# EAGLE board DRYER CONTROLLER (EAGLE 7.4.0), part 1 of 3
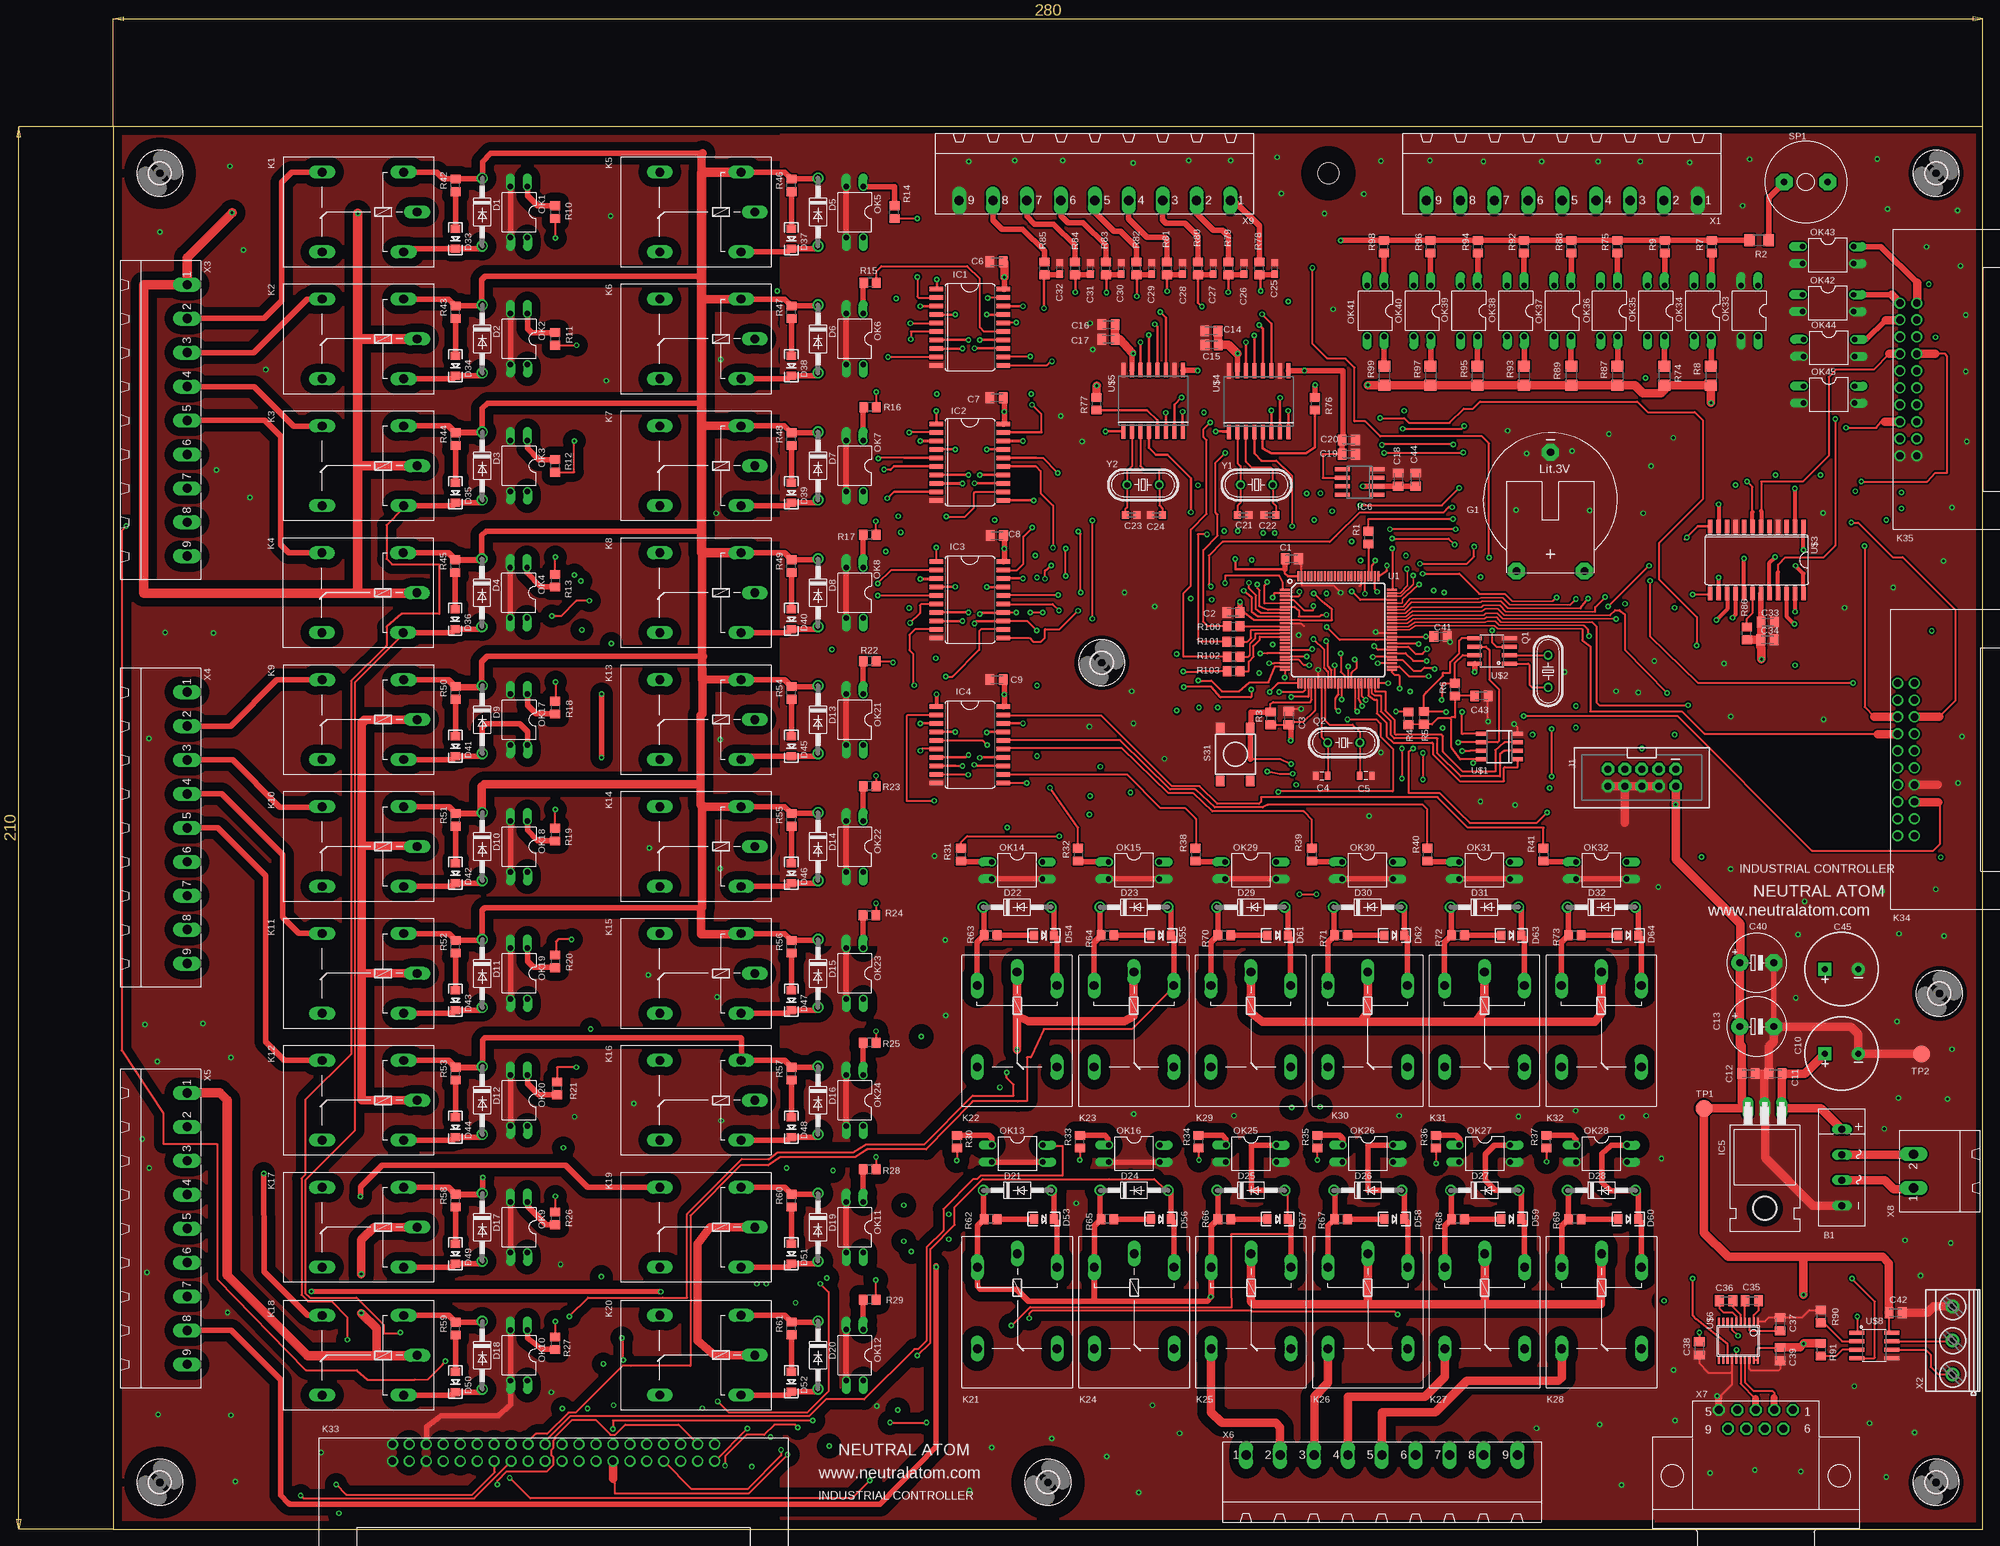
[diagram p6: board, top side]
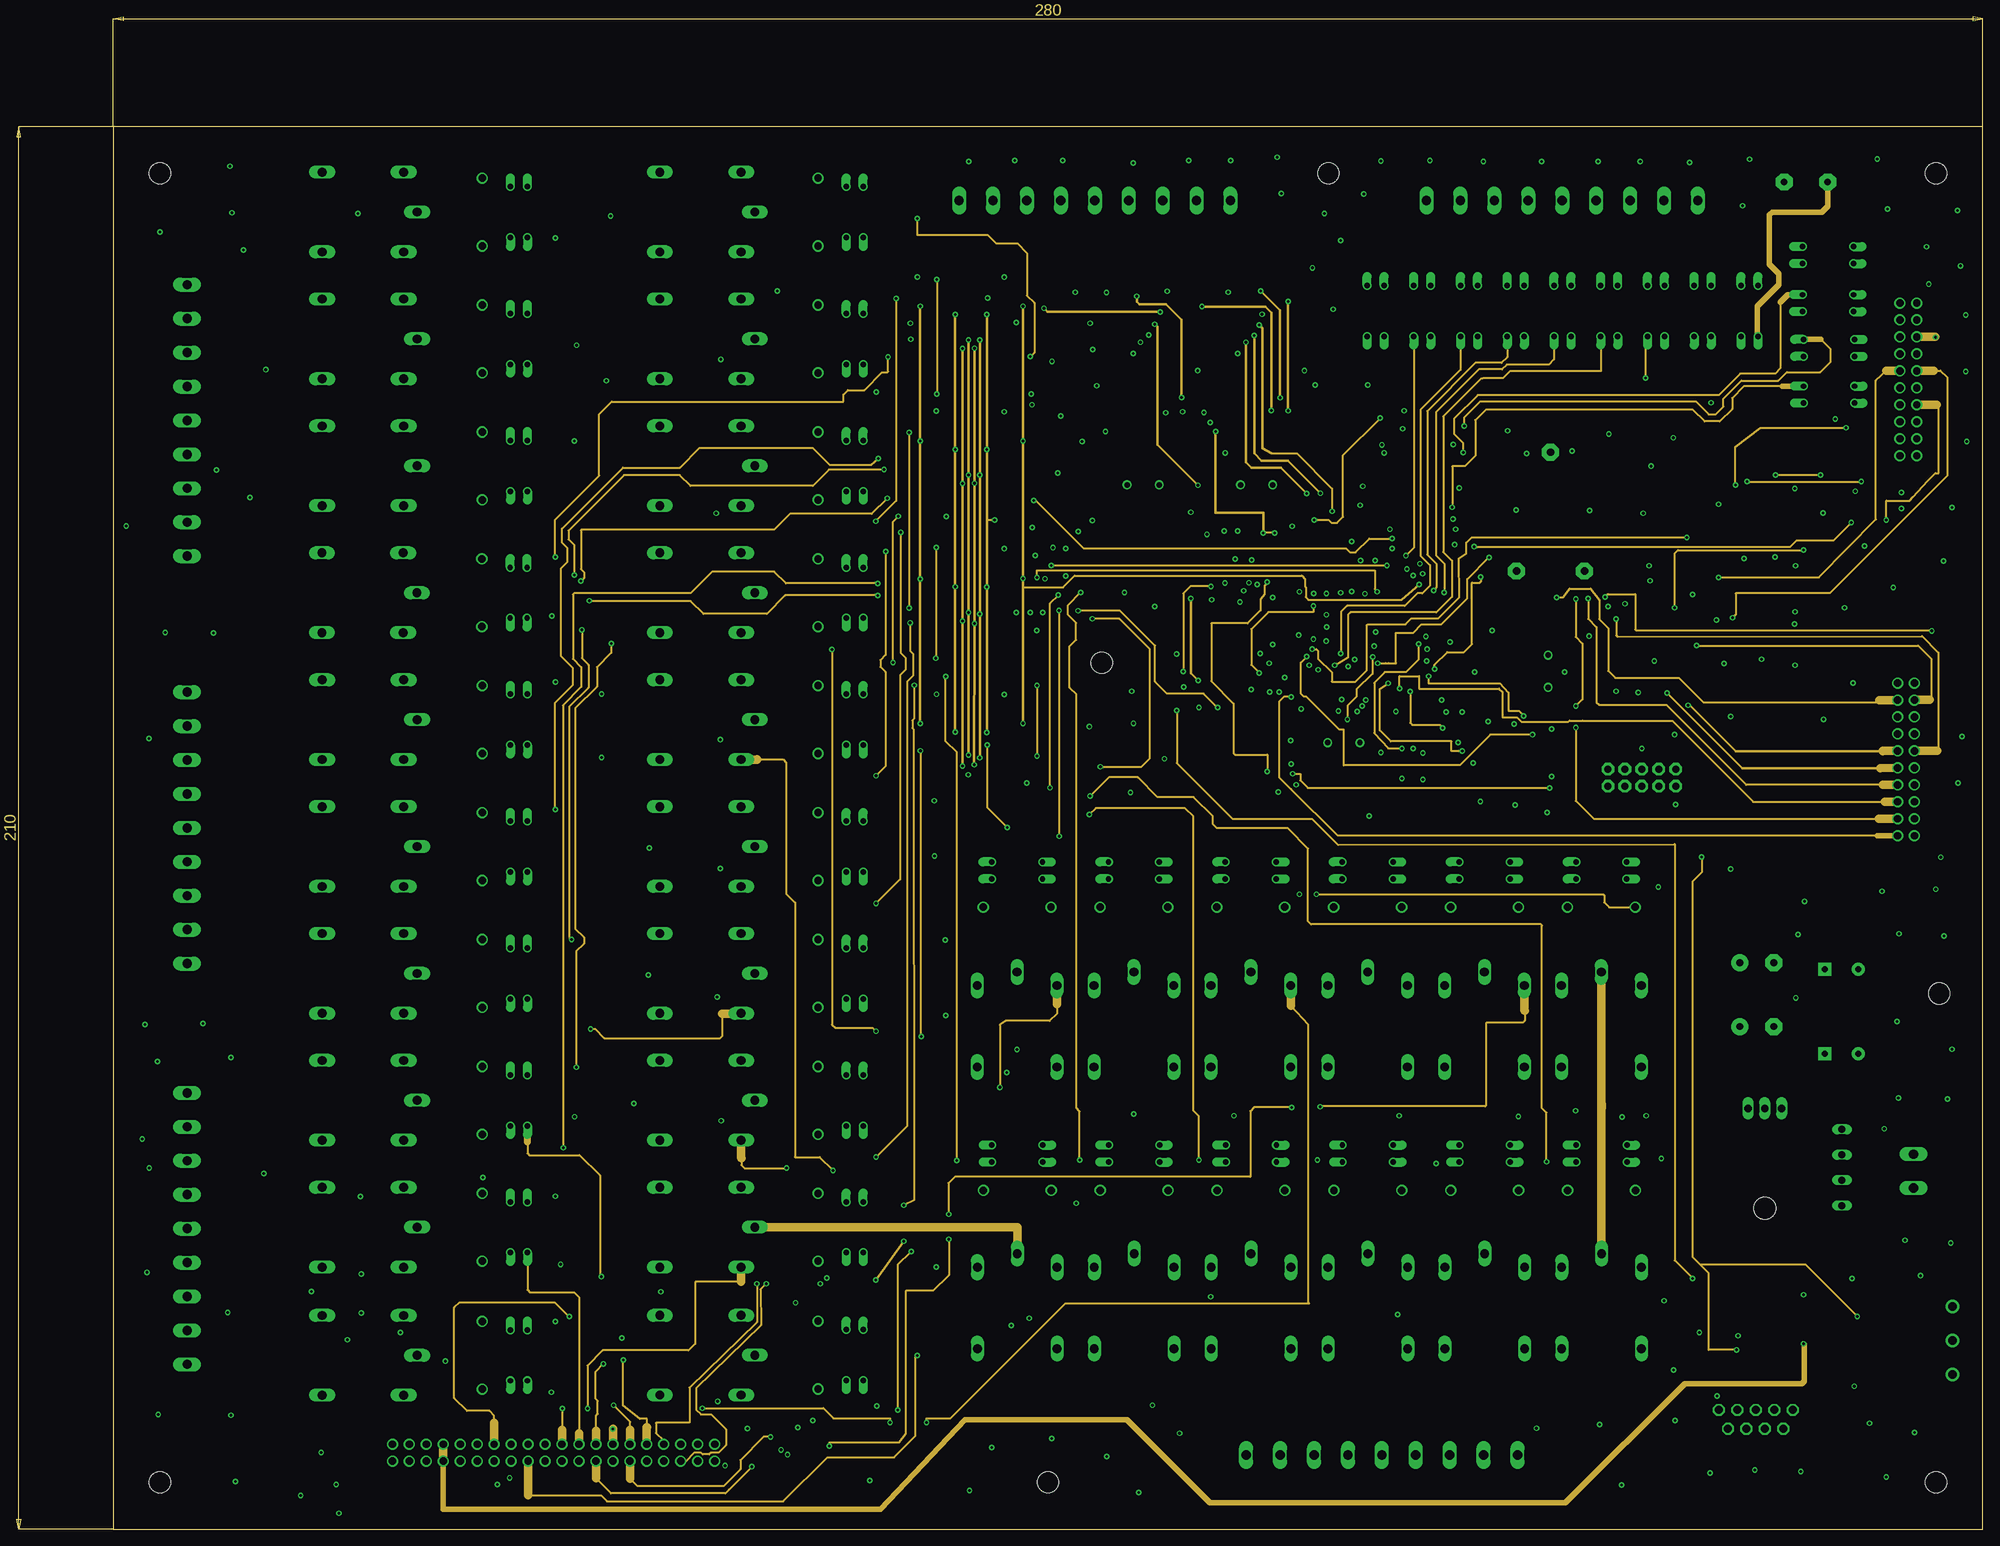
[diagram p7: board, inner layer Route2]
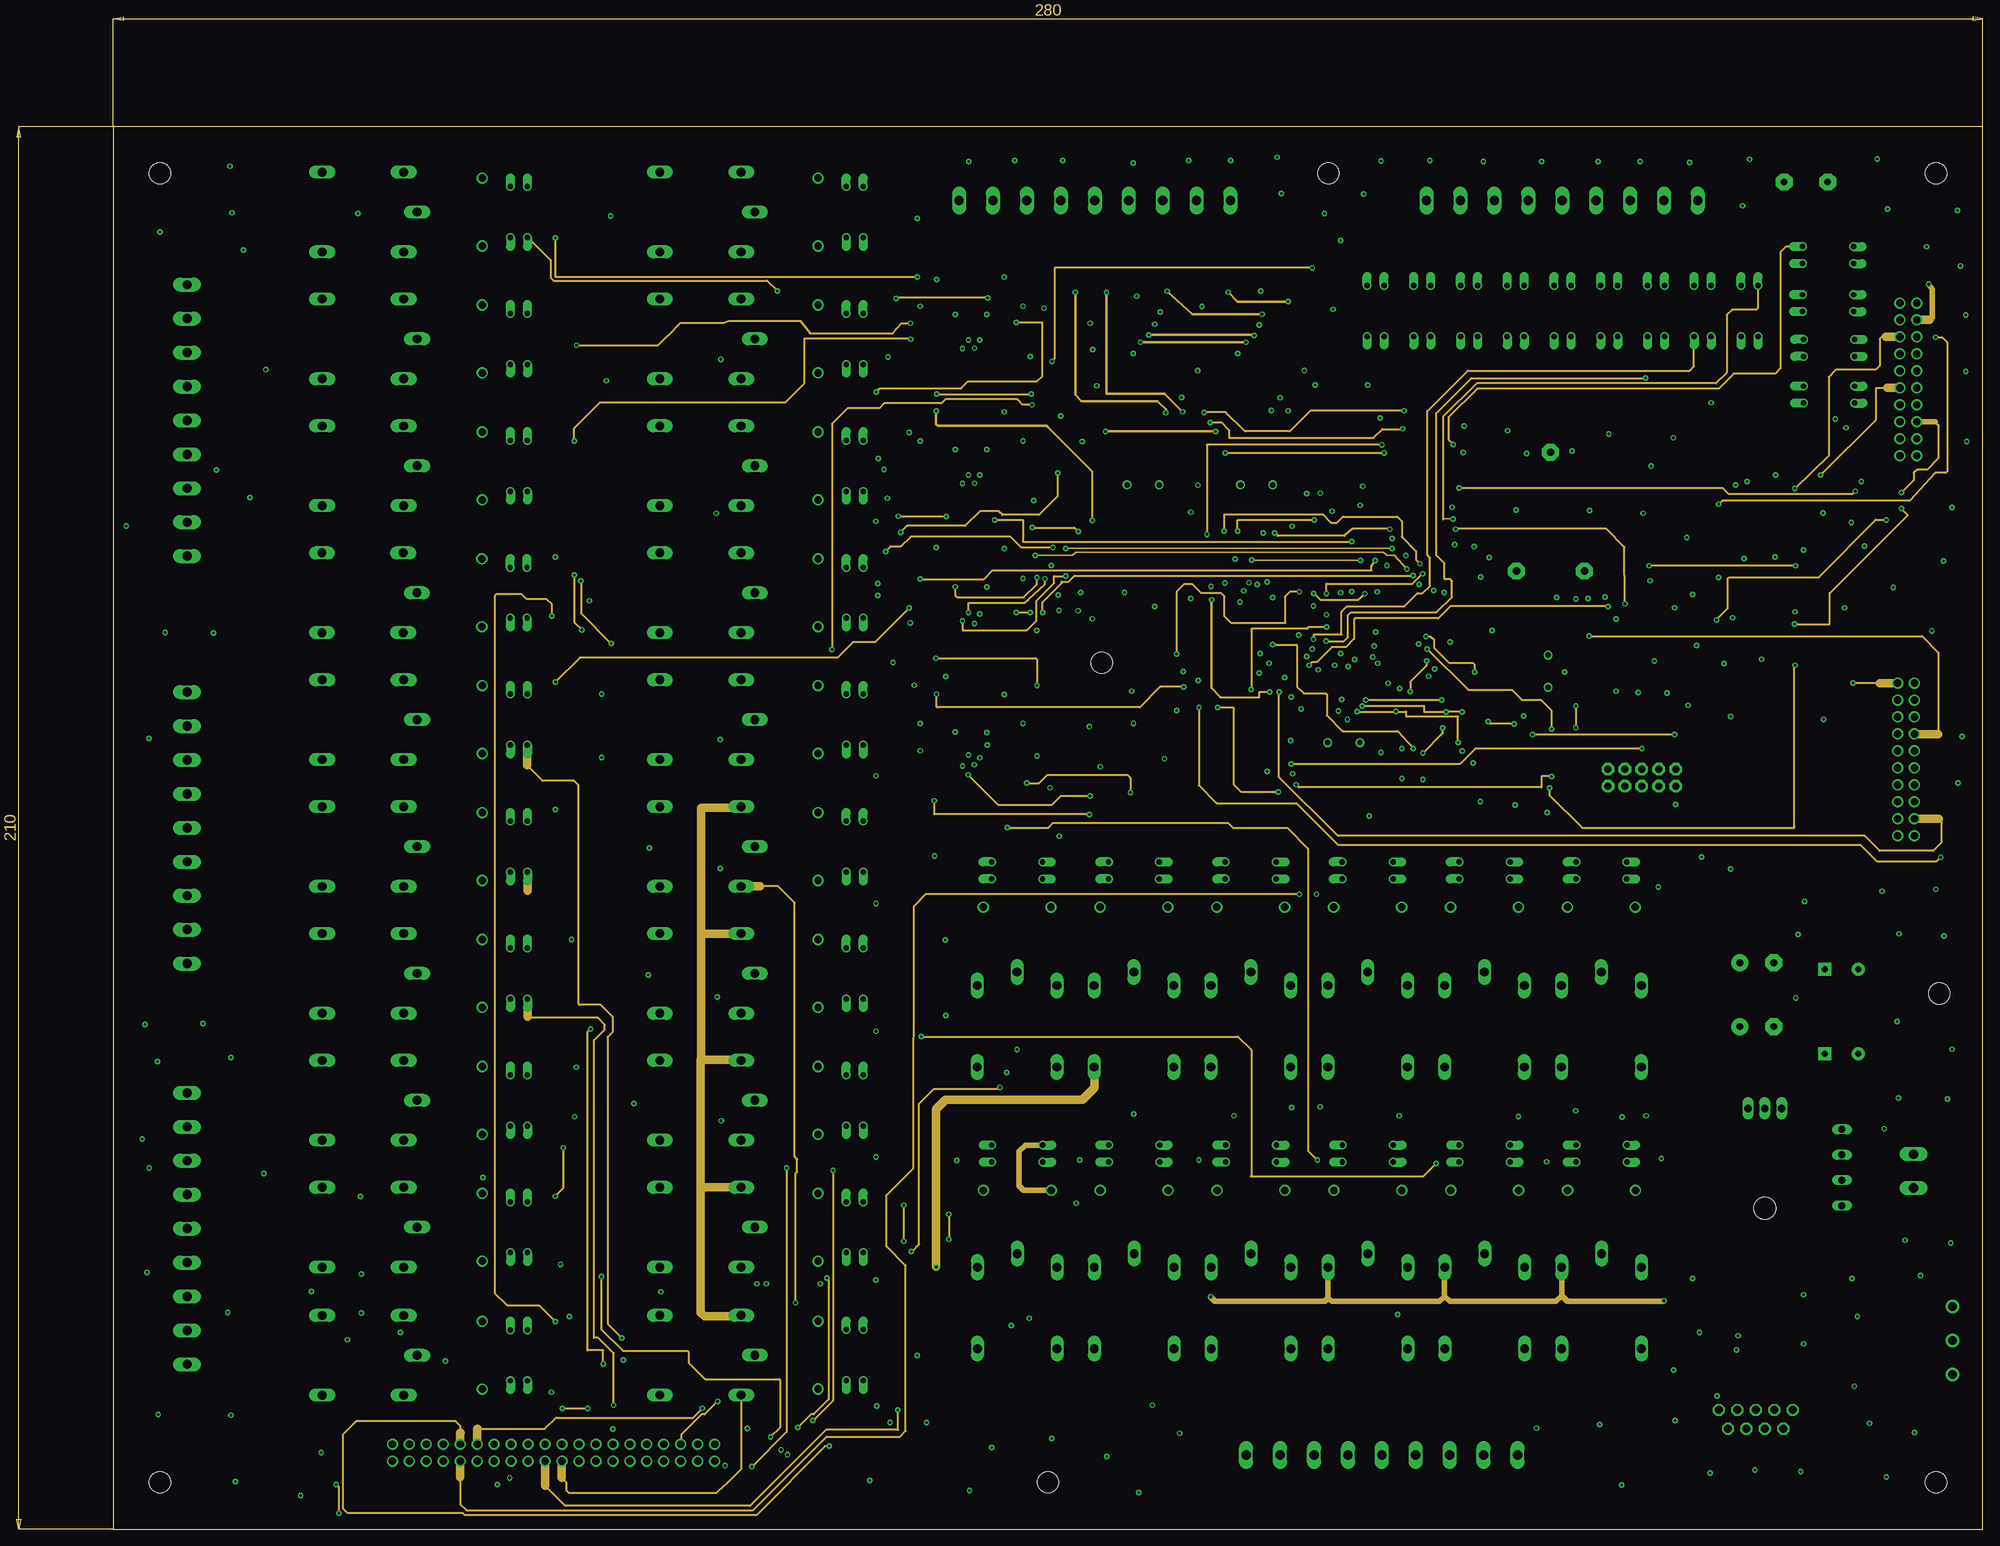
[diagram p8: board, inner layer Route15]
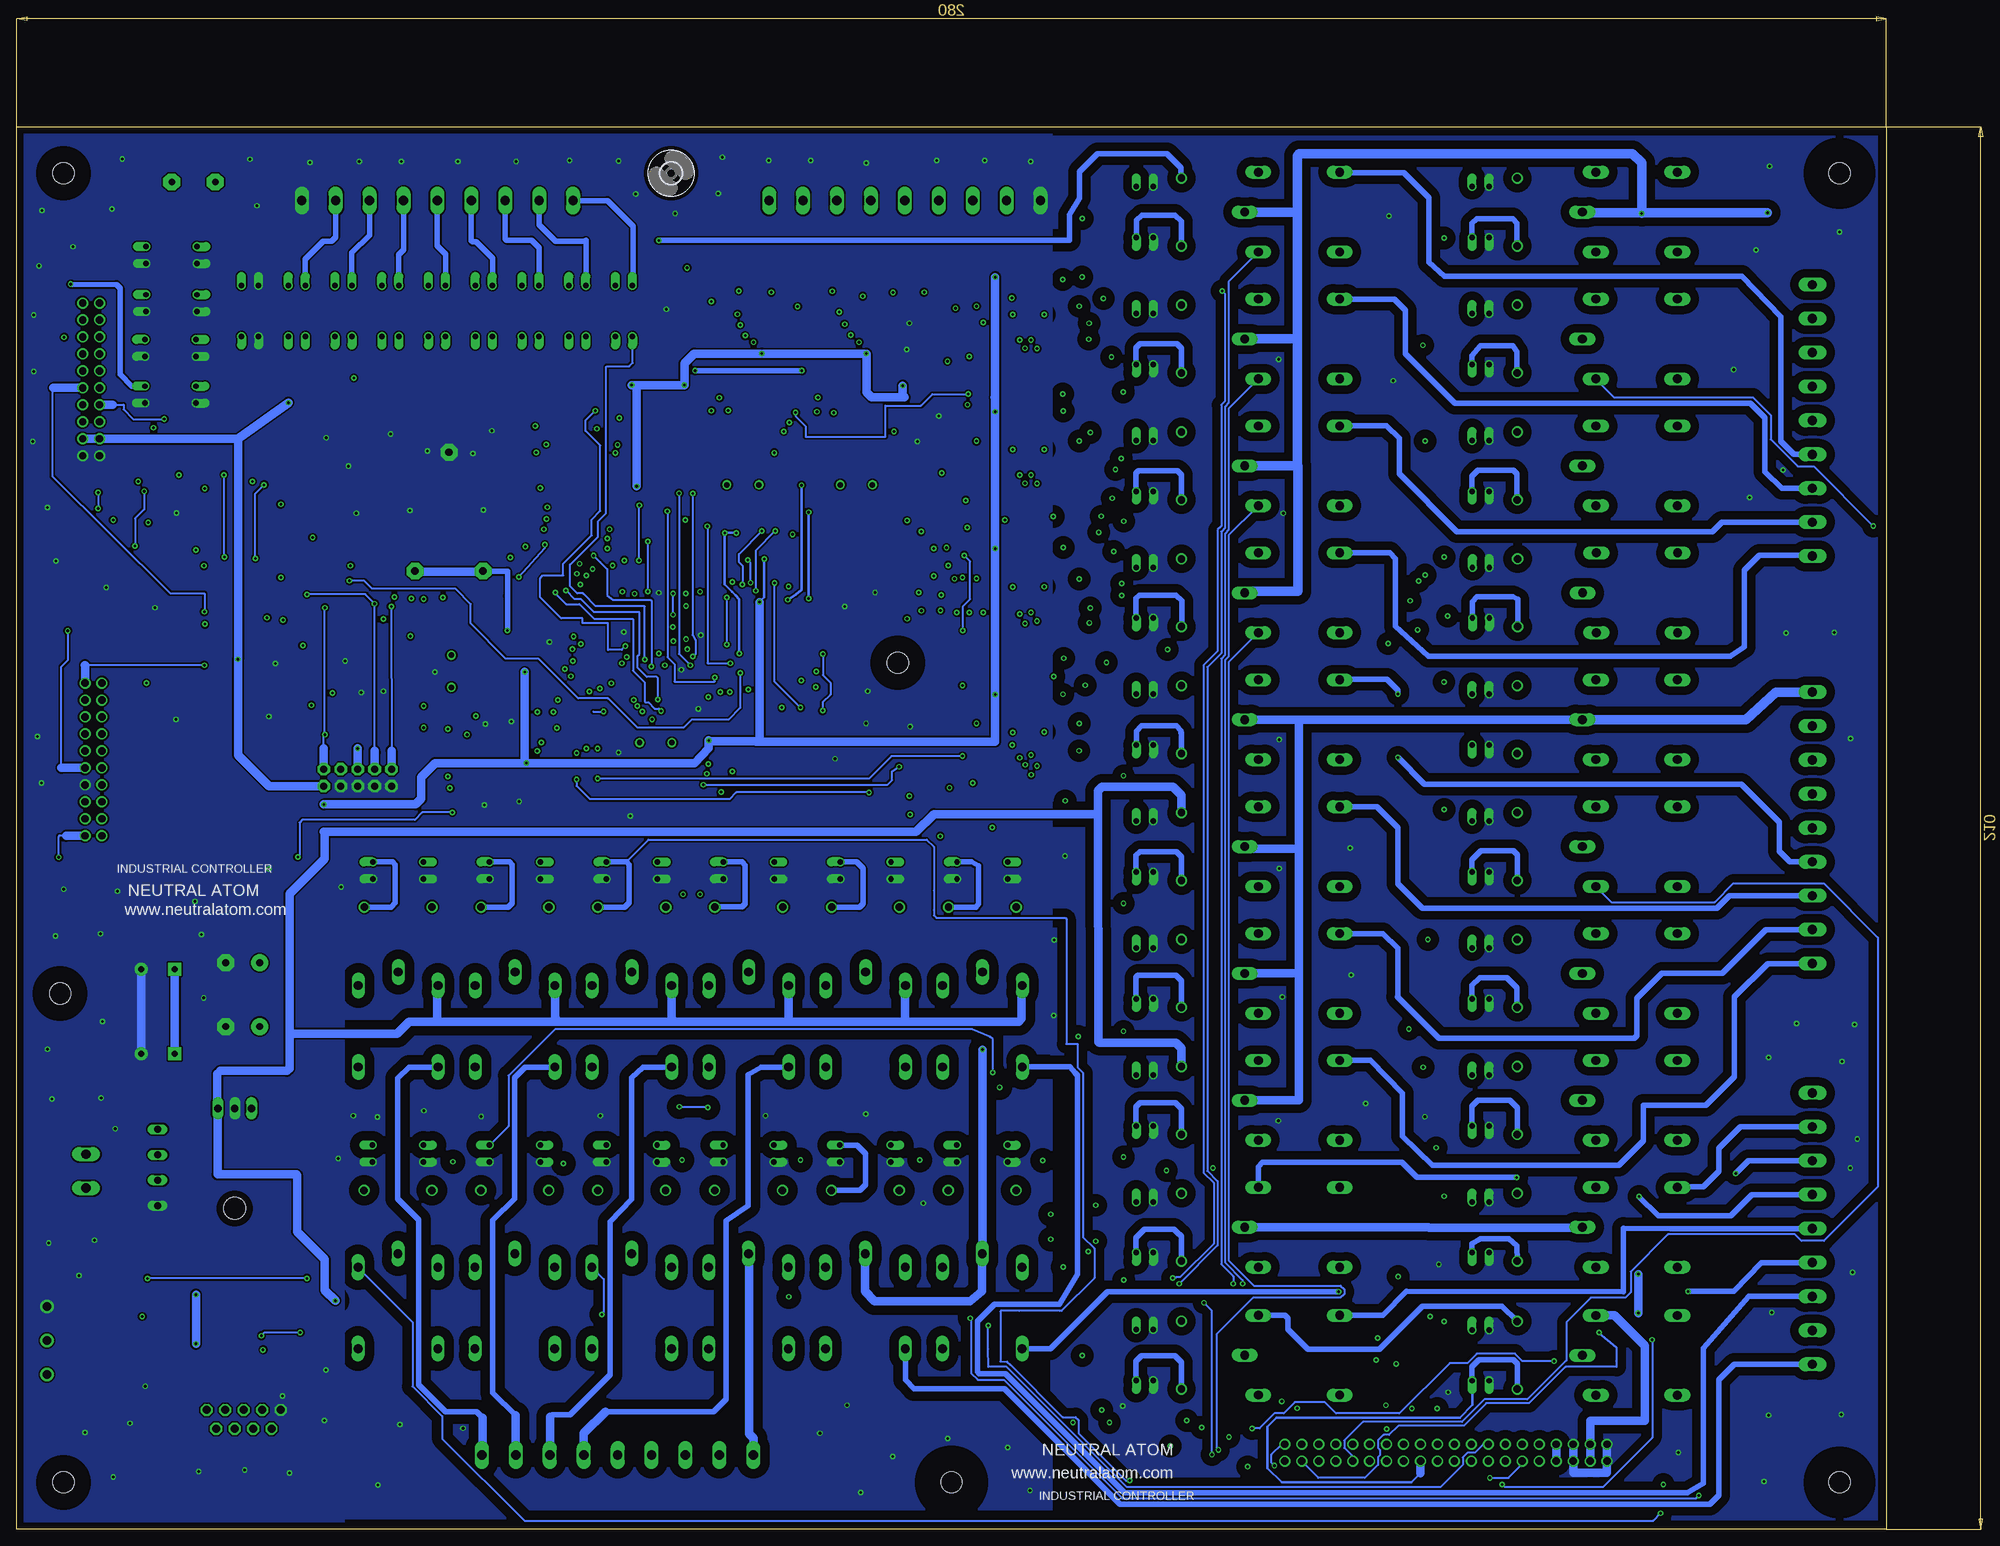
[diagram p9: board, bottom side, seen from below]

Size 280 x 210 mm. Coordinates in mm from the lower left corner, seen from the top.
Outline: 0,0 280,0 280,210 0,210 0,0
Copper layers (1*2*15*16): Top 0.035mm / dielectric 0.5mm / Route2 0.035mm / dielectric 0.5mm / Route15 0.035mm / dielectric 0.5mm / Bottom 0.035mm
Design rules "default *": minimum track width 10mil, minimum drill 24mil, track to track 0.15mm, track to pad 0.15mm, pad to pad 0.15mm, via to via 0.15mm, smd to smd 0.15mm, copper to edge 40mil, drill to drill 8mil, minimum pad ring 10mil, minimum via ring 8mil, stop-mask expansion 4mil, vias tented up to drill 0mil, thermal gap 10mil
Net classes: 0 default: width 0.305 mm, drill 0.4 mm, clearance 0.254 mm; 2 gnd: width 0.305 mm, drill 0.559 mm, clearance 0.254 mm; 3 usbvcc: width 0.508 mm, drill 0.61 mm, clearance 0.254 mm

## Footprints (pad centres in the part's own frame; a part is rotated, then mirrored left to right if it is on the bottom)
2KBP = drill 1.016 long: + 5.715,0; - -5.715,0; AC1 -1.905,0; AC2 1.905,0
C0805K = smd 1.3 x 1.6: 1 -1,0; 2 1,0
0805 = smd 0.8 x 1.2: 1 -0.9,0; 2 0.9,0
CPOL-RADIAL-1000UF-25V-KIT = drill 0.9 pad 1.93 square: + 2.5,0 | drill 0.9 pad 1.93: - -2.5,0
E5-8,5 = drill 1.016 pad 2.54: + -2.54,0 | drill 1.016 pad 2.54 octagon: - 2.54,0
C0603K = smd 1.05 x 1.08: 1 -0.875,0; 2 0.875,0
C0603 = smd 1.1 x 1: 1 -0.85,0; 2 0.85,0
DO41-10 = drill 1.118: A 5.08,0; C -5.08,0
LED-1206 = smd 1.2 x 1.4: A -1.5,0; C 1.5,0
CR2032H = drill 1.118 pad 2.54 octagon: + 5.08,10.795; +@1 -5.08,10.795; - 0,-6.985
3,2 = hole 3.2: 0,0
SO20W = smd 0.66 x 2.032: 1 -5.715,-5.029; 2 -4.445,-5.029; 3 -3.175,-5.029; 4 -1.905,-5.029; 5 -0.635,-5.029; 6 0.635,-5.029; 7 1.905,-5.029; 8 3.175,-5.029; 9 4.445,-5.029; 10 5.715,-5.029; 11 5.715,5.029; 12 4.445,5.029; 13 3.175,5.029; 14 1.905,5.029; 15 0.635,5.029; 16 -0.635,5.029; 17 -1.905,5.029; 18 -3.175,5.029; 19 -4.445,5.029; 20 -5.715,5.029
TO220H = drill 1.118 long: 1 -2.54,-10.16; 2 0,-10.16; 3 2.54,-10.16 | hole 3.302: 0,4.826
SO8 = smd 0.6 x 2.2: 1 -1.905,-2.6; 2 -0.635,-2.6; 3 0.635,-2.6; 4 1.905,-2.6; 5 1.905,2.6; 6 0.635,2.6; 7 -0.635,2.6; 8 -1.905,2.6
2X5-SHROUDED = drill 1.016 pad 1.88 octagon: 1 -1.27,5.08; 2 1.27,5.08; 3 -1.27,2.54; 4 1.27,2.54; 5 -1.27,0; 6 1.27,0; 7 -1.27,-2.54; 8 1.27,-2.54; 9 -1.27,-5.08; 10 1.27,-5.08
G5LE = drill 1.321 long: 1 -7.493,-5.969; 2 -7.493,5.969; O 4.699,5.969; P -9.525,0; S 4.699,-5.969
61204022121 = drill 1.1: 1 5.08,1.27; 2 5.08,-1.27; 3 2.54,1.27; 4 2.54,-1.27; 5 0,1.27; 6 0,-1.27; 7 -2.54,1.27; 8 -2.54,-1.27; 9 -5.08,1.27; 10 -5.08,-1.27; 11 -7.62,1.27; 12 -7.62,-1.27; 13 -10.16,1.27; 14 -10.16,-1.27; 15 -12.7,1.27; 16 -12.7,-1.27; 17 -15.24,1.27; 18 -15.24,-1.27; 19 -17.78,1.27; 20 -17.78,-1.27; 21 -20.32,1.27; 22 -20.32,-1.27; 23 -22.86,1.27; 24 -22.86,-1.27; 25 -25.4,1.27; 26 -25.4,-1.27; 27 -27.94,1.27; 28 -27.94,-1.27; 29 -30.48,1.27; 30 -30.48,-1.27; 31 -33.02,1.27; 32 -33.02,-1.27; 33 -35.56,1.27; 34 -35.56,-1.27; 35 -38.1,1.27; 36 -38.1,-1.27; 37 -40.64,1.27; 38 -40.64,-1.27; 39 -43.18,1.27; 40 -43.18,-1.27
61202022121 = drill 1.1: 1 5.08,1.27; 2 5.08,-1.27; 3 2.54,1.27; 4 2.54,-1.27; 5 0,1.27; 6 0,-1.27; 7 -2.54,1.27; 8 -2.54,-1.27; 9 -5.08,1.27; 10 -5.08,-1.27; 11 -7.62,1.27; 12 -7.62,-1.27; 13 -10.16,1.27; 14 -10.16,-1.27; 15 -12.7,1.27; 16 -12.7,-1.27; 17 -15.24,1.27; 18 -15.24,-1.27; 19 -17.78,1.27; 20 -17.78,-1.27
DIL04 = drill 0.813 offset: 1 -1.27,-3.81; 2 1.27,-3.81; 3 1.27,3.81; 4 -1.27,3.81
HC49/S = drill 0.813: 1 -2.413,0; 2 2.413,0
R0805 = smd 1.3 x 1.5: 1 -0.95,0; 2 0.95,0
R1206 = smd 1.6 x 1.803: 1 -1.422,0; 2 1.422,0
TACTILE_SWITCH_TALL = smd 1.55 x 1.3: A1 -3.975,-2.25; A2 3.975,-2.25; B1 -3.975,2.25; B2 3.975,2.25
AL60P = drill 1.016 pad 2.54 octagon: 1 -3.251,0; 2 3.251,0
B2,54 = smd 2.54 x 2.54: TP 0,0
TQFP100 = smd 1.5 x 0.3: 1 -8,6; 2 -8,5.5; 3 -8,5; 4 -8,4.5; 5 -8,4; 6 -8,3.5; 7 -8,3; 8 -8,2.5; 9 -8,2; 10 -8,1.5; 11 -8,1; 12 -8,0.5; 13 -8,0; 14 -8,-0.5; 15 -8,-1; 16 -8,-1.5; 17 -8,-2; 18 -8,-2.5; 19 -8,-3; 20 -8,-3.5; 21 -8,-4; 22 -8,-4.5; 23 -8,-5; 24 -8,-5.5; 25 -8,-6; 51 8,-6; 52 8,-5.5; 53 8,-5; 54 8,-4.5; 55 8,-4; 56 8,-3.5; 57 8,-3; 58 8,-2.5; 59 8,-2; 60 8,-1.5; 61 8,-1; 62 8,-0.5; 63 8,0; 64 8,0.5; 65 8,1; 66 8,1.5; 67 8,2; 68 8,2.5; 69 8,3; 70 8,3.5; 71 8,4; 72 8,4.5; 73 8,5; 74 8,5.5; 75 8,6 | smd 0.3 x 1.5: 26 -6,-8; 27 -5.5,-8; 28 -5,-8; 29 -4.5,-8; 30 -4,-8; 31 -3.5,-8; 32 -3,-8; 33 -2.5,-8; 34 -2,-8; 35 -1.5,-8; 36 -1,-8; 37 -0.5,-8; 38 0,-8; 39 0.5,-8; 40 1,-8; 41 1.5,-8; 42 2,-8; 43 2.5,-8; 44 3,-8; 45 3.5,-8; 46 4,-8; 47 4.5,-8; 48 5,-8; 49 5.5,-8; 50 6,-8; 76 6,8; 77 5.5,8; 78 5,8; 79 4.5,8; 80 4,8; 81 3.5,8; 82 3,8; 83 2.5,8; 84 2,8; 85 1.5,8; 86 1,8; 87 0.5,8; 88 0,8; 89 -0.5,8; 90 -1,8; 91 -1.5,8; 92 -2,8; 93 -2.5,8; 94 -3,8; 95 -3.5,8; 96 -4,8; 97 -4.5,8; 98 -5,8; 99 -5.5,8; 100 -6,8
SOIC8 = smd 0.6 x 1.5: 1 -1.905,-2.75; 2 -0.635,-2.75; 3 0.635,-2.75; 4 1.905,-2.75; 5 1.905,2.75; 6 0.635,2.75; 7 -0.635,2.75; 8 -1.905,2.75
SO08 = smd 0.61 x 2.21: 1 -1.905,-2.616; 2 -0.635,-2.616; 3 0.635,-2.616; 4 1.905,-2.616; 5 1.905,2.616; 6 0.635,2.616; 7 -0.635,2.616; 8 -1.905,2.616
SO24L = smd 0.66 x 2.032: 1 -6.985,-5.029; 2 -5.715,-5.029; 3 -4.445,-5.029; 4 -3.175,-5.029; 5 -1.905,-5.029; 6 -0.635,-5.029; 7 0.635,-5.029; 8 1.905,-5.029; 9 3.175,-5.029; 10 4.445,-5.029; 11 5.715,-5.029; 12 6.985,-5.029; 13 6.985,5.029; 14 5.715,5.029; 15 4.445,5.029; 16 3.175,5.029; 17 1.905,5.029; 18 0.635,5.029; 19 -0.635,5.029; 20 -1.905,5.029; 21 -3.175,5.029; 22 -4.445,5.029; 23 -5.715,5.029; 24 -6.985,5.029
SO-16W = smd 0.6 x 2.2: 1 -4.445,-4.6; 2 -3.175,-4.6; 3 -1.905,-4.6; 4 -0.635,-4.6; 5 0.635,-4.6; 6 1.905,-4.6; 7 3.175,-4.6; 8 4.445,-4.6; 9 4.445,4.6; 10 3.175,4.6; 11 1.905,4.6; 12 0.635,4.6; 13 -0.635,4.6; 14 -1.905,4.6; 15 -3.175,4.6; 16 -4.445,4.6
TSSOP20 = smd 0.305 x 0.991: 1 -2.925,-2.918; 2 -2.275,-2.918; 3 -1.625,-2.918; 4 -0.975,-2.918; 5 -0.325,-2.918; 6 0.325,-2.918; 7 0.975,-2.918; 8 1.625,-2.918; 9 2.275,-2.918; 10 2.925,-2.918; 11 2.925,2.918; 12 2.275,2.918; 13 1.625,2.918; 14 0.975,2.918; 15 0.325,2.918; 16 -0.325,2.918; 17 -0.975,2.918; 18 -1.625,2.918; 19 -2.275,2.918; 20 -2.925,2.918
MSTBA9 = drill 1.397 long: 1 -20.32,5.08; 2 -15.24,5.08; 3 -10.16,5.08; 4 -5.08,5.08; 5 0,5.08; 6 5.08,5.08; 7 10.16,5.08; 8 15.24,5.08; 9 20.32,5.08
MKDSN1,5/3-5,08 = drill 1.3 pad 2: 1 -7.641,0.025; 2 -2.561,0.025; 3 2.519,0.025
177-009-FEMALE = drill 1.194 pad 1.524 octagon: 1 -5.537,-9.84; 2 -2.769,-9.84; 3 0,-9.84; 4 2.769,-9.84; 5 5.537,-9.84; 6 -4.153,-6.997; 7 -1.384,-6.997; 8 1.384,-6.997; 9 4.153,-6.997
MSTBA2 = drill 1.397 long: 1 -2.54,5.08; 2 2.54,5.08
HC49U-V = drill 0.813: 1 -2.413,0; 2 2.413,0

## Placement (x,y rotation side)
B1  [2KBP]  258.9,54.15 90 top
C1  0.1uF/50V  [C0805K]  176.5,145.3 0 top
C2  0.1uF/50V  [C0805K]  167.75,137.25 180 top
C3  0.1uF/50V  [C0805K]  176.05,121.45 90 top
C4  22pF  [0805]  181,112.8 0 top
C5  22pF  [0805]  187.6,112.8 180 top
C6  0.1uF/50V  [C0805K]  132.3,189.75 180 top
C7  0.1uF/50V  [C0805K]  132.3,169.4 180 top
C8  0.1uF/50V  [C0805K]  132.35,148.75 180 top
C9  0.1uF/50V  [C0805K]  132.3,127.2 180 top
C10  1000uf/25V  [CPOL-RADIAL-1000UF-25V-KIT]  258.85,71.2 180 top
C11  0.1uF/25V  [C0805K]  248.95,68.2 180 top
C12  0.1uF/25V  [C0805K]  244.9,68.2 0 top
C13  560uF/16V  [E5-8,5]  246.15,75.25 0 top
C14  10uF/10V  [C0805K]  164.45,179.4 180 top
C15  0.1uF/50V  [C0805K]  164.5,177.3 180 top
C16  10uF/10V  [C0805K]  149.05,180.35 180 top
C17  0.1uF/50V  [C0805K]  149.05,178.15 180 top
C18  1uF/25V  [C0805K]  192.45,157.15 90 top
C19  0.1uF/50V  [C0805K]  185.05,160.95 0 top
C20  10uF/10V  [C0805K]  185.05,163.05 0 top
C21  30pF  [C0603K]  169.25,151.85 0 top
C22  30pF  [C0603K]  173.25,151.85 180 top
C23  30pF  [C0603K]  152.45,151.85 0 top
C24  30pF  [C0603K]  156.25,151.85 180 top
C25  0.01uF/50V  [C0603]  173.95,188.75 90 top
C26  0.01uF/50V  [C0603]  169.35,188.75 90 top
C27  0.01uF/50V  [C0603]  164.75,188.75 90 top
C28  0.01uF/50V  [C0603]  160.15,188.75 90 top
C29  0.01uF/50V  [C0603]  155.55,188.75 90 top
C30  0.01uF/50V  [C0603]  150.95,188.75 90 top
C31  0.01uF/50V  [C0603]  146.35,188.75 90 top
C32  0.01uF/50V  [C0603]  141.75,188.75 90 top
C33  0.1uF/25V  [C0805K]  247.8,135.8 0 top
C34  10uF/10V  [C0805K]  247.75,133.15 0 top
C35  0.047uF/50V  [C0805K]  245.4,34.2 180 top
C36  0.33uF/50V  [C0805K]  241.55,34.2 180 top
C37  0.33uF/50V  [C0805K]  249.65,30.7 90 top
C38  1uF/50V  [C0805K]  237.55,27.05 90 top
C39  0.1uF/50V  [C0805K]  249.65,26.2 270 top
C40  560uF/16V  [E5-8,5]  246.15,84.8 0 top
C41  0.1uF/50V  [C0805K]  198.8,133.65 0 top
C42  0.1uF/50V  [C0805K]  266.95,32.4 0 top
C43  0.1uF/50V  [C0805K]  204.9,124.75 0 top
C44  0.1uF/50V  [C0805K]  195.05,157.15 90 top
C45  1000uf/25V  [CPOL-RADIAL-1000UF-25V-KIT]  258.85,83.85 180 top
D1  1N4004  [DO41-10]  55.27,197.2 270 top
D2  1N4004  [DO41-10]  55.27,178.2 270 top
D3  1N4004  [DO41-10]  55.27,159.2 270 top
D4  1N4004  [DO41-10]  55.22,140.2 270 top
D5  1N4004  [DO41-10]  105.56,197.2 270 top
D6  1N4004  [DO41-10]  105.56,178.2 270 top
D7  1N4004  [DO41-10]  105.56,159.2 270 top
D8  1N4004  [DO41-10]  105.56,140.2 270 top
D9  1N4004  [DO41-10]  55.27,121.2 270 top
D10  1N4004  [DO41-10]  55.27,102.2 270 top
D11  1N4004  [DO41-10]  55.27,83.2 270 top
D12  1N4004  [DO41-10]  55.27,64.2 270 top
D13  1N4004  [DO41-10]  105.56,121.2 270 top
D14  1N4004  [DO41-10]  105.56,102.2 270 top
D15  1N4004  [DO41-10]  105.56,83.2 270 top
D16  1N4004  [DO41-10]  105.56,64.2 270 top
D17  1N4004  [DO41-10]  55.27,45.2 270 top
D18  1N4004  [DO41-10]  55.27,26.03 270 top
D19  1N4004  [DO41-10]  105.56,45.2 270 top
D20  1N4004  [DO41-10]  105.56,26.05 270 top
D21  1N4004  [DO41-10]  135.4,50.73 0 top
D22  1N4004  [DO41-10]  135.37,93.12 0 top
D23  1N4004  [DO41-10]  152.87,93.12 0 top
D24  1N4004  [DO41-10]  152.9,50.73 0 top
D25  1N4004  [DO41-10]  170.4,50.73 0 top
D26  1N4004  [DO41-10]  187.9,50.73 0 top
D27  1N4004  [DO41-10]  205.4,50.73 0 top
D28  1N4004  [DO41-10]  222.9,50.73 0 top
D29  1N4004  [DO41-10]  170.37,93.12 0 top
D30  1N4004  [DO41-10]  187.87,93.12 0 top
D31  1N4004  [DO41-10]  205.37,93.12 0 top
D32  1N4004  [DO41-10]  222.87,93.12 0 top
D33  [LED-1206]  51.27,193.2 270 top
D34  [LED-1206]  51.27,174.2 270 top
D35  [LED-1206]  51.27,155.2 270 top
D36  [LED-1206]  51.22,136.2 270 top
D37  [LED-1206]  101.56,193.2 270 top
D38  [LED-1206]  101.56,174.2 270 top
D39  [LED-1206]  101.56,155.2 270 top
D40  [LED-1206]  101.56,136.2 270 top
D41  [LED-1206]  51.27,117.2 270 top
D42  [LED-1206]  51.27,98.2 270 top
D43  [LED-1206]  51.27,79.2 270 top
D44  [LED-1206]  51.27,60.2 270 top
D45  [LED-1206]  101.56,117.2 270 top
D46  [LED-1206]  101.56,98.2 270 top
D47  [LED-1206]  101.56,79.2 270 top
D48  [LED-1206]  101.56,60.2 270 top
D49  [LED-1206]  51.27,41.2 270 top
D50  [LED-1206]  51.27,22.03 270 top
D51  [LED-1206]  101.56,41.2 270 top
D52  [LED-1206]  101.56,22.05 270 top
D53  [LED-1206]  139.4,46.43 0 top
D54  [LED-1206]  139.4,88.89 0 top
D55  [LED-1206]  156.9,88.89 0 top
D56  [LED-1206]  156.9,46.43 0 top
D57  [LED-1206]  174.4,46.43 0 top
D58  [LED-1206]  191.9,46.43 0 top
D59  [LED-1206]  209.4,46.43 0 top
D60  [LED-1206]  226.9,46.43 0 top
D61  [LED-1206]  174.4,88.89 0 top
D62  [LED-1206]  191.9,88.89 0 top
D63  [LED-1206]  209.4,88.89 0 top
D64  [LED-1206]  226.9,88.89 0 top
DRILEGEND  [DRILEGEND]  -17.1,-9.64 0 top  (outside the outline)
G1  CR2032H  [CR2032H]  215.25,154.25 180 top
H1  MOUNT-HOLE3.2  [3,2]  7,203 0 top
H2  MOUNT-HOLE3.2  [3,2]  148.05,129.72 0 top
H3  MOUNT-HOLE3.2  [3,2]  7,7 0 top
H4  MOUNT-HOLE3.2  [3,2]  273,203 0 top
H5  MOUNT-HOLE3.2  [3,2]  273.5,80.2 0 top
H6  MOUNT-HOLE3.2  [3,2]  273,7 0 top
H7  MOUNT-HOLE3.2  [3,2]  182,203 0 bottom
H8  MOUNT-HOLE3.2  [3,2]  140,7 0 top
IC1  74HC373DW  [SO20W]  128.3,179.95 270 top
IC2  74HC373DW  [SO20W]  128.3,159.75 270 top
IC3  74HC373DW  [SO20W]  128.3,139.15 270 top
IC4  74HC373DW  [SO20W]  128.3,117.45 270 top
IC5  7805T  [TO220H]  247.35,52.85 180 top
IC6  AD780R  [SO8]  186.7,156.75 90 top
J1  AVR_SPI_PROG2PTH2  [2X5-SHROUDED]  228.93,112.51 270 top
K1  G5LE  [G5LE]  36,197.2 180 top
K2  G5LE  [G5LE]  36,178.2 180 top
K3  G5LE  [G5LE]  36,159.2 180 top
K4  G5LE  [G5LE]  35.95,140.2 180 top
K5  G5LE  [G5LE]  86.56,197.2 180 top
K6  G5LE  [G5LE]  86.56,178.2 180 top
K7  G5LE  [G5LE]  86.56,159.2 180 top
K8  G5LE  [G5LE]  86.56,140.2 180 top
K9  G5LE  [G5LE]  36,121.2 180 top
K10  G5LE  [G5LE]  36,102.2 180 top
K11  G5LE  [G5LE]  36,83.2 180 top
K12  G5LE  [G5LE]  36,64.2 180 top
K13  G5LE  [G5LE]  86.56,121.2 180 top
K14  G5LE  [G5LE]  86.56,102.2 180 top
K15  G5LE  [G5LE]  86.56,83.2 180 top
K16  G5LE  [G5LE]  86.56,64.2 180 top
K17  G5LE  [G5LE]  36,45.2 180 top
K18  G5LE  [G5LE]  36,26.03 180 top
K19  G5LE  [G5LE]  86.56,45.2 180 top
K20  G5LE  [G5LE]  86.56,26.05 180 top
K21  G5LE  [G5LE]  135.4,31.73 270 top
K22  G5LE  [G5LE]  135.37,73.89 270 top
K23  G5LE  [G5LE]  152.87,73.89 270 top
K24  G5LE  [G5LE]  152.9,31.73 270 top
K25  G5LE  [G5LE]  170.4,31.73 270 top
K26  G5LE  [G5LE]  187.9,31.73 270 top
K27  G5LE  [G5LE]  205.4,31.73 270 top
K28  G5LE  [G5LE]  222.9,31.73 270 top
K29  G5LE  [G5LE]  170.37,73.89 270 top
K30  G5LE  [G5LE]  187.87,73.89 270 top
K31  G5LE  [G5LE]  205.37,73.89 270 top
K32  G5LE  [G5LE]  222.87,73.89 270 top
K33  61204022121  [61204022121]  85,11.45 0 top
K34  61202022121  [61202022121]  268.5,121.6 90 top
K35  61202022121  [61202022121]  268.85,178.5 90 top
OK1  PC817  [DIL04]  60.77,197.2 180 top
OK2  PC817  [DIL04]  60.77,178.2 180 top
OK3  PC817  [DIL04]  60.77,159.2 180 top
OK4  PC817  [DIL04]  60.72,140.2 180 top
OK5  PC817  [DIL04]  111.06,197.2 180 top
OK6  PC817  [DIL04]  111.06,178.2 180 top
OK7  PC817  [DIL04]  111.06,159.2 180 top
OK8  PC817  [DIL04]  111.06,140.2 180 top
OK9  PC817  [DIL04]  60.77,45.2 180 top
OK10  PC817  [DIL04]  60.77,26.03 180 top
OK11  PC817  [DIL04]  111.06,45.2 180 top
OK12  PC817  [DIL04]  111.06,26.05 180 top
OK13  PC817  [DIL04]  135.4,56.23 270 top
OK14  PC817  [DIL04]  135.37,98.62 270 top
OK15  PC817  [DIL04]  152.87,98.62 270 top
OK16  PC817  [DIL04]  152.9,56.23 270 top
OK17  PC817  [DIL04]  60.77,121.2 180 top
OK18  PC817  [DIL04]  60.77,102.2 180 top
OK19  PC817  [DIL04]  60.77,83.2 180 top
OK20  PC817  [DIL04]  60.77,64.2 180 top
OK21  PC817  [DIL04]  111.06,121.2 180 top
OK22  PC817  [DIL04]  111.06,102.2 180 top
OK23  PC817  [DIL04]  111.06,83.2 180 top
OK24  PC817  [DIL04]  111.06,64.2 180 top
OK25  PC817  [DIL04]  170.4,56.23 270 top
OK26  PC817  [DIL04]  187.9,56.23 270 top
OK27  PC817  [DIL04]  205.4,56.23 270 top
OK28  PC817  [DIL04]  222.9,56.23 270 top
OK29  PC817  [DIL04]  170.37,98.62 270 top
OK30  PC817  [DIL04]  187.87,98.62 270 top
OK31  PC817  [DIL04]  205.37,98.62 270 top
OK32  PC817  [DIL04]  222.87,98.62 270 top
OK33  PC817  [DIL04]  245.05,182.4 180 top
OK34  PC817  [DIL04]  238.05,182.4 180 top
OK35  PC817  [DIL04]  231.05,182.4 180 top
OK36  PC817  [DIL04]  224.05,182.4 180 top
OK37  PC817  [DIL04]  217.05,182.4 180 top
OK38  PC817  [DIL04]  210.05,182.4 180 top
OK39  PC817  [DIL04]  203.05,182.4 180 top
OK40  PC817  [DIL04]  196.05,182.4 180 top
OK41  PC817  [DIL04]  189.05,182.4 180 top
OK42  PC817  [DIL04]  256.8,183.55 270 top
OK43  PC817  [DIL04]  256.8,190.75 270 top
OK44  PC817  [DIL04]  256.95,176.85 270 top
OK45  PC817  [DIL04]  256.95,169.85 270 top
Q1  32Khz  [HC49/S]  214.9,128.45 90 top
Q2  16MHz  [HC49/S]  184.3,117.75 180 top
R1  10K  [R0805]  188,148.45 270 top
R2  150E, 1206  [R1206]  246.5,192.95 0 top
R3  10K  [R0805]  173.35,121.4 270 top
R4  10K  [R0805]  194,121.4 90 top
R5  10K  [R0805]  196.3,121.45 90 top
R6  10K  [R0805]  200.95,125.7 90 top
R7  10K  [R0805]  239.4,192 90 top
R8  [R1206]  239.3,172.7 90 top
R9  10K  [R0805]  232.35,192 90 top
R10  120E  [R0805]  66.2,197.2 90 top
R11  120E  [R0805]  66.2,178.2 90 top
R12  120E  [R0805]  66.2,159.2 90 top
R13  120E  [R0805]  66.2,142 270 top
R14  120E  [R0805]  117,197.2 90 top
R15  120E  [R0805]  113.35,186.65 180 top
R16  120E  [R0805]  113.35,168 180 top
R17  120E  [R0805]  113.29,148.85 180 top
R18  120E  [R0805]  66.2,123 270 top
R19  120E  [R0805]  66.2,104 270 top
R20  120E  [R0805]  66.2,85 270 top
R21  120E  [R0805]  66.45,66 270 top
R22  120E  [R0805]  113.29,129.95 180 top
R23  120E  [R0805]  113.29,111.25 180 top
R24  120E  [R0805]  113.24,91.9 180 top
R25  120E  [R0805]  113.29,72.85 180 top
R26  120E  [R0805]  66.2,46.53 270 top
R27  120E  [R0805]  66.2,27.83 270 top
R28  120E  [R0805]  113.29,53.85 180 top
R29  120E  [R0805]  113.29,34.35 180 top
R30  120E  [R0805]  126.35,58 90 top
R31  120E  [R0805]  126.97,101 270 top
R32  120E  [R0805]  144.5,101 270 top
R33  120E  [R0805]  144.78,58 90 top
R34  120E  [R0805]  162.56,58 90 top
R35  120E  [R0805]  180.34,58 90 top
R36  120E  [R0805]  198.12,58 90 top
R37  120E  [R0805]  214.63,58 90 top
R38  120E  [R0805]  162.1,101 270 top
R39  120E  [R0805]  179.5,101 270 top
R40  120E  [R0805]  196.8,101 270 top
R41  120E  [R0805]  214.2,101 270 top
R42  1K  [R0805]  51.27,201.2 90 top
R43  1K  [R0805]  51.27,182.2 90 top
R44  1K  [R0805]  51.27,163.2 90 top
R45  1K  [R0805]  51.22,144.2 90 top
R46  1K  [R0805]  101.56,201.2 90 top
R47  1K  [R0805]  101.56,182.2 90 top
R48  1K  [R0805]  101.56,163.2 90 top
R49  1K  [R0805]  101.56,144.2 90 top
R50  1K  [R0805]  51.27,125.2 90 top
R51  1K  [R0805]  51.27,106.2 90 top
R52  1K  [R0805]  51.27,87.2 90 top
R53  1K  [R0805]  51.27,68.2 90 top
R54  1K  [R0805]  101.56,125.2 90 top
R55  1K  [R0805]  101.56,106.2 90 top
R56  1K  [R0805]  101.56,87.2 90 top
R57  1K  [R0805]  101.56,68.2 90 top
R58  1K  [R0805]  51.27,49.2 90 top
R59  1K  [R0805]  51.27,30.03 90 top
R60  1K  [R0805]  101.56,49.2 90 top
R61  1K  [R0805]  101.56,30.05 90 top
R62  1K  [R0805]  131.4,46.43 180 top
R63  1K  [R0805]  131.4,88.89 180 top
R64  1K  [R0805]  148.9,88.89 180 top
R65  1K  [R0805]  148.9,46.43 180 top
R66  1K  [R0805]  166.4,46.43 180 top
R67  1K  [R0805]  183.9,46.43 180 top
R68  1K  [R0805]  201.4,46.43 180 top
R69  1K  [R0805]  218.9,46.43 180 top
R70  1K  [R0805]  166.4,88.89 180 top
R71  1K  [R0805]  183.9,88.89 180 top
R72  1K  [R0805]  201.4,88.89 180 top
R73  1K  [R0805]  218.9,88.89 180 top
R74  [R1206]  232.3,172.7 90 top
R75  10K  [R0805]  225.25,192 90 top
R76  10k  [R0805]  180,168.5 270 top
R77  10k  [R0805]  147.25,168.5 270 top
R78  150E  [R0805]  171.65,188.75 90 top
R79  150E  [R0805]  167.05,188.75 90 top
R80  150E  [R0805]  162.45,188.75 90 top
R81  150E  [R0805]  157.85,188.75 90 top
R82  150E  [R0805]  153.25,188.75 90 top
R83  150E  [R0805]  148.65,188.75 90 top
R84  150E  [R0805]  144.05,188.75 90 top
R85  150E  [R0805]  139.45,188.75 90 top
R86  10k  [R0805]  244.65,134.1 90 top
R87  [R1206]  225.3,172.7 90 top
R88  10K  [R0805]  218.35,192 90 top
R89  [R1206]  218.35,172.7 90 top
R90  [R0805]  255.75,31.85 270 top
R91  [R0805]  255.75,26.85 270 top
R92  10K  [R0805]  211.3,192 90 top
R93  [R1206]  211.3,172.7 90 top
R94  10K  [R0805]  204.35,192 90 top
R95  [R1206]  204.3,172.7 90 top
R96  10K  [R0805]  197.3,192 90 top
R97  [R1206]  197.3,172.7 90 top
R98  10K  [R0805]  190.3,192 90 top
R99  [R1206]  190.35,172.7 90 top
R100  10K  [R0805]  167.8,135.15 0 top
R101  10K  [R0805]  167.75,132.9 0 top
R102  10K  [R0805]  167.8,130.65 0 top
R103  10K  [R0805]  167.8,128.45 0 top
S31  SWITCH-MOMENTARY-2SMD-4  [TACTILE_SWITCH_TALL]  168.05,116 90 top
SP1  AL60P  [AL60P]  253.5,201.7 0 top
TP1  PTR1B2,54  [B2,54]  238.25,63 0 top
TP2  PTR1B2,54  [B2,54]  270.85,71.15 0 top
U1  ATMEGA2560AU  [TQFP100]  183.47,134.64 0 top
U$1  CAT24C128  [SOIC8]  207.6,117.15 90 top
U$2  DS1307SO8  [SO08]  206.5,131.5 90 top
U$3  MAX7219CWG  [SO24L]  246.15,145.1 180 top
U$4  AD7705  [SO-16W]  171.55,168.85 0 top
U$5  AD7705  [SO-16W]  155.75,168.95 0 top
U$6  MAX13223  [TSSOP20]  243.4,28.2 180 top
U$8  RS485SOIC  [SO08]  263.75,27.5 270 top
X1  MSTBA9  [MSTBA9]  217,204 180 top
X2  MKDSN1,5/3-5,08  [MKDSN1,5/3-5,08]  275.5,30.8 90 top
X3  MSTBA9  [MSTBA9]  6,166 270 top
X4  MSTBA9  [MSTBA9]  6,105 270 top
X5  MSTBA9  [MSTBA9]  6,45 270 top
X6  MSTBA9  [MSTBA9]  190,6 0 top
X7  [177-009-FEMALE]  246,8 180 top
X8  MSTBA2  [MSTBA2]  274.7,53.6 90 top
X9  MSTBA9  [MSTBA9]  147,204 180 top
Y1  4.9512 MHz  [HC49U-V]  171.25,156.35 180 top
Y2  4.9512 MHz  [HC49U-V]  154.25,156.35 180 top

## Tracks (layer width: path | path; a pad name or v marks a point on that pad's centre or on a via)
+5V  (via drill 0.4)
  Top 0.305: U1.31 179.97,122.55 178.21,120.79 176.39,120.79 C3.1 R3.2 | 175.46,136.16 170.78,136.16 169.2,137.35 169.13,137.37 168.87,137.37 | 175.46,136.16 U1.10 | U1.100 | 203.9,129.58 U$2.8 203.88,128.37 v203.9,128.35 | C43.1 R6.1 200.95,121.55 200.4,121.55 200.25,121.4 | R4.1 R5.1 197.5,120.5 198.4,121.4 200.25,121.4 | 168.4,173.43 U$4.15 | 165.45,177.35 C15.1 | 152.6,173.53 U$5.15 | U$6.19 U$6.20 246.32,27.07 246.4,27.15 249.6,27.15 C39.1 | 252.65,27.2 253.25,27.8 R91.1 | C42.1 265.95,29.82 U$8.8 | 253.2,27.8 v253.15,27.75 | 253.15,40.5 253.4,40.75 | v203.65,114.7 203.65,115.19 U$1.8 201.75,115.25 200.4,117.05 200.4,121.25 200.25,121.4 | 246.78,135.81 C33.1 | 192.45,156.12 C18.1 | U1.61 v196.6,133.64 C41.1 | 168.87,137.37 168.74,137.37 168.75,137.65 | 168.87,137.37 C2.1 | 175.46,136.16 177.75,136.16 177.75,136.1 182.55,136.1 182.55,137.7 181.1,138.85 v179.8,140.1 | v187.47,140.05 U1.80 | U1.100 177.45,142.62 175.93,142.62 175.91,142.64 | U1.100 175.96,142.64 175.5,143.1 | C1.1 175.45,145.25 175.45,145.1 175.4,145.15 | 175.5,143.05 175.45,143.1 175.45,143.15 | U1.100 175.91,142.64 | 175.91,142.64 175.5,143.05 | 175.5,143.05 175.5,143.1 | 175.5,143.1 175.45,143.15 | 175.45,143.15 175.45,143.7
  Top 0.406: 133.33,127.17 C9.1 | 189.3,156.15 IC6.2 | 175.45,143.7 168.05,143.7 v168.05,145.25
  Top 0.813: U$3.19 246.78,135.81 | IC6.2 192.45,156.12 | C18.1 C44.1 | IC1.20 133.45,185.66 v133.45,187.45 | 133.45,189.6 C6.1 | 133.45,165.59 v133.45,167.3 133.45,169.25 C7.1 | 133.45,165.59 IC2.20 133.45,165.55 133.45,165.59 | 133.45,145.04 v133.45,146.8 133.5,148.6 C8.1 | 133.45,145.04 IC3.20 133.37,144.87 133.45,144.95 133.45,145.04 | C9.1 133.45,127.05 v133.45,124.95 133.45,123.29 IC4.20 | R76.1 v180,171.3 | 190.33,171.3 R99.1 | U$4.15 168.4,173.47 v168.4,176 167.05,177.35 165.45,177.35 | U$5.15 152.6,173.57 152.6,175.95 v152.75,176 152.6,176.1 | v176.35,118.1 176.35,120.15 C3.1 | 168.75,137.65 v168.75,138.8 | 203.9,129.58 v203.9,128.35 | v187.15,156.15 189.3,156.15 | 175.45,145.1 175.45,143.7
  Top 1.27: C15.1 167.05,177.3 v168.4,176 | C14.1 165.45,177.35 | C39.1 252.65,27.2 | IC5.3 TP1.TP | IC5.3 243.9,63.92 C12.1 243.9,72.3 243.6,72.6 C13.+ C40.+ 243.65,84.84 243.65,90.65 234.01,100.29 v234.01,108.5 J1.2 | IC5.3 238.34,63.01 238.25,63.1 238.25,44.4 241.9,40.75 253.4,40.75 265.05,40.75 265.9,39.8 265.9,32.45 C42.1 | R91.1 253.2,27.8 | v253.15,35.1 253.15,40.5 | v246.85,130.25 246.85,132 246.7,132.15 246.7,133.1 C34.1 | C34.1 R86.1 | C33.1 246.8,133.2 C34.1 | v133.45,187.45 133.45,189.6 | v187.9,171.3 190.33,171.3 | 152.6,176.1 150.8,178.15 C17.1 C16.1 | R77.1 147.25,171.15 v147.3,171.2 | 188,171.28 R99.1 R97.1 R95.1 R93.1 R89.1 R87.1 227.87,171.28 229.1,170.05 231.8,170.05 232.4,170.65 R74.1 R8.1 v239.3,168.65
  Route2 0.813: 49.4,10.1 49.45,10.1 49.45,3 114.9,3 127.55,16.4 151.8,16.4 164.25,3.95 217.5,3.95 235.35,21.8 252.9,21.8 253.25,22.15 253.25,27.65 v253.15,27.75
  Route2 1.27: K33.33 49.4,12.72 49.4,10.1
  Route15 0.305: v179.8,140.1 180.8,139.15 186.45,139.15 v187.47,140.05 | v203.9,128.35 203.9,129.45 203.7,129.65 200.1,129.65 197.85,131.9 197.85,133.09 197.3,133.64 v196.6,133.64
  Bottom 0.406: v168.05,145.25 168.05,139.5 v168.75,138.8
  Bottom 0.813: 168.75,118 168.8,117.95 | 176.2,117.95 v176.35,118.1
  Bottom 1.27: v253.15,27.75 v253.15,35.1 | v203.65,114.7 217.35,114.7 219.4,112.55 219.4,109.35 220.25,108.5 v234.01,108.5 | J1.2 242.19,111.24 246.85,115.9 v246.85,130.25 246.85,163.26 | v133.45,187.45 v133.45,167.3 | v133.45,167.3 v133.45,146.8 v133.45,124.95 133.45,117.95 133.5,117.9 169.25,117.9 169.3,117.95 | v176.35,118.1 176.35,116.9 178.45,114.7 v203.65,114.7 | v168.75,138.8 168.75,118 | 168.8,117.95 169.3,117.95 | 169.3,117.95 176.2,117.95 | 133.55,169.45 133.45,169.35 v133.45,167.3 | v147.3,171.2 147.3,169.75 147,169.45 151.95,169.45 152.75,170.25 v152.75,176 v168.4,176 178.55,176 180,174.55 v180,171.3 v187.9,171.3 187.15,171.25 v187.15,156.15 | v203.9,128.35 203.9,114.95 v203.65,114.7 | v239.3,168.65 247.05,163.1 246.85,163.26 | 246.85,163.26 K35.17 K35.18 | K33.33 K33.34
+12V  (via drill 0.4)
  Top 0.813: K1.1 48.48,203.17 49.45,202.2 51.22,202.2 R42.2 | R42.2 55.14,202.15 D1.C | K2.1 50.25,184.17 R43.2 | R43.2 55.14,183.15 D2.C | K4.1 50.2,146.17 | 50.2,146.17 R45.2 51.25,145.15 | 51.25,145.15 55.09,145.15 D4.C | K3.1 50.25,165.17 | 50.25,165.17 R44.2 55.14,164.15 D3.C | K9.1 50.25,127.17 | 50.25,127.17 R50.2 55.14,126.15 D9.C | K10.1 50.25,108.17 | 50.25,108.17 R51.2 55.14,107.15 D10.C | K11.1 50.25,89.17 | 50.25,89.17 R52.2 51.3,88.15 | 55.1,88.15 55.14,88.15 D11.C | K12.1 50.25,70.17 | 50.25,70.17 R53.2 55.14,69.15 D12.C | K17.1 50.25,51.17 | 50.25,51.17 R58.2 55.14,50.15 D17.C | K18.1 50.25,32 R59.2 55.14,30.98 D18.C | R42.2 49.55,202.15 | 49.55,202.15 49.45,202.15 48.5,203.1 48.6,203.1 49.55,202.15 | R42.2 55.2,202.15 55.3,202.25 55.3,204.75 56.55,206 88.25,206 | K5.1 100.54,203.17 R46.2 105.43,202.15 D5.C | R43.2 55.05,183.15 55.2,183.3 55.2,187.1 55.7,187.6 87.82,187.6 | K6.1 100.54,184.17 R47.2 105.56,183.15 D6.C | 50.25,165.17 50.25,165.15 51.15,164.25 55.25,164.25 55.25,167.8 56.05,168.6 88.22,168.6 | K7.1 94.1,165.22 100.49,165.22 R48.2 105.43,164.15 D7.C | 50.2,146.17 50.23,146.17 51.25,145.15 | 51.25,145.15 51.25,145.1 54.95,145.1 55.2,145.35 55.2,148.8 55.85,149.4 87.97,149.4 | K8.1 100.54,146.17 R49.2 105.43,145.15 D8.C | 50.25,127.17 50.25,127.05 51.3,126 54.85,126 55.2,126.35 55.2,129.9 56,130.7 88.32,130.7 | K13.1 100.54,127.17 R54.2 105.43,126.15 D13.C | 50.25,108.17 50.28,108.17 51.05,107.4 51.05,107.35 51.3,107.1 55.1,107.1 55.2,107.2 | 55.2,111.2 55.55,111.55 | K14.1 100.54,108.17 R55.2 105.43,107.15 D14.C | 50.25,89.17 50.28,89.17 51.3,88.15 | 51.3,88.15 55.1,88.15 | 55.1,88.15 55.25,88.3 55.25,92.65 55.6,93 88.2,93 88.05,92.85
  Top 0.813: 50.25,70.17 50.25,70.15 51.3,69.1 55.15,69.1 55.3,69.25 55.3,73.2 55.65,73.55 93.95,73.55 94.1,73.4 94.1,70.22 K16.1 100.54,70.17 R57.2 105.43,69.15 D16.C | 50.25,51.17 50.25,51.15 51.3,50.1 55.05,50.1 55.3,50.35 55.3,52.6 v55.35,52.65 | D15.C 105.43,88.15 R56.2 100.54,89.17 K15.1 | D19.C 105.43,50.15 R60.2 100.54,51.17 K19.1 | K20.1 100.54,32.02 R61.2 105.43,31 D20.C | D22.C 130.45,92.96 R63.2 129.4,87.84 K22.1 | D23.C 147.79,89.05 R64.2 | K23.1 146.9,87.84 R64.2 | K29.1 164.4,81.45 | D29.C 165.45,92.96 R70.2 164.4,87.84 164.4,81.45 | D30.C 182.79,89.05 R71.2 181.9,87.84 K30.1 | D31.C 200.45,92.96 R72.2 199.4,87.84 K31.1 | D32.C 217.95,92.96 R73.2 216.9,87.84 K32.1 | D21.C 130.32,46.56 R62.2 129.43,45.41 K21.1 129.43,39.17 129.45,39.15 129.45,36.35 129.85,35.95 135.3,35.95 137.1,34.15 146.9,34.15 | R65.2 146.93,45.41 K24.1 146.9,39.19 146.9,34.15 | D24.C 147.82,46.56 R65.2 | R66.2 165.45,50.6 D25.C | R66.2 164.43,45.41 K25.1 164.4,39.19 164.4,34.7 163.85,34.15 146.9,34.15 | K26.1 181.93,45.41 R67.2 182.95,50.6 D26.C | K27.1 199.43,45.41 R68.2 200.45,50.6 D27.C | K28.1 216.93,45.41 R69.2 217.95,50.6 D28.C | R2.1 R7.2 R9.2 R75.2 R88.2 R92.2 R94.2 R96.2 R98.2 v183.85,192.95 | R65.2 147.93,46.43 146.95,45.45 146.95,34.2 146.9,34.15 | R66.2 165.43,46.43 164.45,45.45 164.45,34.9 v164.35,34.8 | R64.2 147.95,88.85 146.95,87.85 | 164.4,81.45
  Top 1.27: 55.2,107.2 55.2,111.2 | 55.55,111.55 88,111.55 | B1.+ 255.75,63.01 IC5.1 249.89,68.14 C11.1 253.35,68.2 C10.+ | K5.1 88.22,203.17 88.15,203.1 88.15,205.9 88.25,206 | 87.97,149.4 88.15,149.22 88.15,146.65 88.2,146.6 88.2,127.15 88.25,127.22 | K6.1 88.37,184.17 | 88.37,184.17 88.15,183.95 | 88.37,184.17 88.12,184.17 88.1,184.15 88.1,187.32 87.82,187.6 | 88.22,168.6 88.22,165.52 88.15,165.45 | K7.1 88.32,165.17 88.15,165 | 88.25,127.22 88.22,130.6 88.32,130.7 | 88.25,127.22 88.25,122.1 88,121.85 88,111.55 | 88.25,127.22 K13.1 | 88,111.55 88,108.45 88.3,108.15 94.03,108.15 K14.1 | 88.05,92.85 88.05,89.05 93.93,89.05 K15.1 | 88.2,93 88.2,108.3 88.25,108.35
  Top 1.422: K5.1 88.22,203.17 88.15,203.1 88.15,183.95 88.15,165.45 88.15,165 88.15,146.65 88.15,146.2 94.02,146.2 K8.1
  Route15 0.813: v164.35,34.8 165,34.15 181.5,34.15 181.95,34.6 | 181.95,34.6 181.95,39.2 K26.1 | K28.1 216.93,34.98 | 216.93,34.98 216.05,34.15 200.2,34.15 199.4,34.9 | 199.4,34.9 199.4,34.8 198.65,34.15 182.5,34.15 181.95,34.6 | 199.4,34.9 199.4,39.19 K27.1 | 216.93,34.98 216.93,34.97 217.8,34.1 232.15,34.1 v232.25,34.2
  Route15 1.27: K20.1 93.88,31.85 88.55,31.85 88,32.4 88,51.15 | K19.1 94.02,51.2 88.05,51.2 88,51.15 | 88,51.15 88,70.25 88.2,70.25 | 88.2,70.25 93.97,70.25 K16.1 | 88.05,89.15 88.07,89.17 K15.1 88.32,89.17 88.05,88.9 | 88.05,89.15 88.05,88.9 | 88.05,88.9 88.05,70.4 88.2,70.25 | 88.05,89.15 88.05,107.95 88.1,108 94.25,108 94.3,108.05
  Bottom 0.305: 93.4,54.9 93.4,54.85 93.95,54.3
  Bottom 0.813: v55.35,52.65 70.3,52.65 72.55,54.9 93.4,54.9 94.05,54.25 K19.1 | K20.1 90.07,32.02 89.65,31.6 89.65,29.9 86.65,26.9 75.95,26.9 69.45,33.4 57.56,33.4 D18.C | 217,76 216.95,75.95 | 249.55,68.6 C11.1 | 249.95,63.07 IC5.1 | 146.95,81.33 K23.1 | v183.85,192.95 122.35,192.95 122.35,196.8 120.85,199.25 120.85,203.25 118.15,205.95 107.7,205.95 105.6,203.85 105.6,202.32 D5.C
  Bottom 1.27: K18.1 40.75,32 36.2,27.45 36.2,16.2 44.36,16.2 K33.37 K33.38 | IC5.1 249.89,53.11 249.9,53.1 238.1,53.1 238,53 238,44.55 233.85,40.4 233.85,35.8 v232.25,34.2 | 216.95,75.95 221.25,75.95 223,74.2 239.1,74.2 239.15,74.25 | 249.55,68.6 239.5,68.6 239.15,68.95 239.15,74.25 | C11.1 249.95,63.07 | 198.85,76 217,76 217,81.28 K32.1 | 198.85,76 181.5,76 | 181.5,76 164.4,76 | 164.4,76 146.95,76 | 146.95,76 129.9,76 129.5,76.4 129.5,81.28 K22.1 | 146.95,76 146.95,81.33 | 164.4,76 K29.1 | 239.15,74.25 239.15,95.15 233.9,100.4 233.9,104.3 234,104.4 145.3,104.4 142.65,107.05 118.25,107.05 118.05,107.25 | 118.05,107.25 118,72.9 117.75,72.8 106.35,72.8 105.56,72.01 D16.C | D14.C 105.56,109.86 106.85,111.15 117.45,111.15 118.05,110.55 118.05,107.25 | 181.5,76 181.9,76.4 K30.1 | K31.1 199.4,76.55 198.85,76 | C45.+ C10.+
A
  Top 0.305: U$8.6 271.44,26.86 272.2,26.1 272.2,24.3 273.3,23.2 275.43,23.2 X2.1
A0
  Top 0.305: U1.47 187.97,124.83 188.9,124.2 189.25,124.2 189.25,122.15 190.7,120.7 190.7,118.75 191.7,117.75 197.5,117.75 197.65,117.6 197.65,116 201.65,112 208.3,112 208.3,114 208.4,114.1 210.35,114.1 U$1.1
A1
  Top 0.305: U1.48 188.47,125.18 188.95,124.85 189.85,124.85 189.85,122.45 191.3,121 191.3,119 191.85,118.4 198.35,118.4 198.35,116.15 201.8,112.7 207.7,112.7 207.7,116.05 208.37,116.52 U$1.2
A2
  Top 0.305: U1.49 188.97,125.48 189,125.45 190.5,125.45 190.5,122.55 191.9,121.15 191.9,119.2 192.15,118.95 198.95,118.95 199.15,118.75 199.15,116.4 202.15,113.4 207,113.4 207,116.65 208.38,117.78 U$1.3
AD0  (via drill 0.4)
  Top 0.305: v189,145.05 188.45,144.15 188.45,142.66 U1.78
  Top 0.406: IC4.3 120.88,120.62 v120.85,120.6 | v120.85,183.1 123.25,183.1 IC1.3 | v120.85,142.25 123.2,142.25 IC3.3 120.92,142.32 v120.85,142.25 | v120.85,162.9 123.25,162.9 IC2.3 120.88,162.93 v120.85,162.9
  Route2 0.406: v120.85,120.6 v120.85,142.25 v120.85,162.9 v120.85,183.1
  Route15 0.305: v120.85,142.25 130.4,142.25 131.7,143.55 188.45,143.55 188.45,144.15 v189,145.05
AD1  (via drill 0.4)
  Top 0.305: v189.3,140.35 188.97,140.75 U1.77
  Top 0.406: IC4.4 v126.1,119.36 v126.1,119.35 | IC3.4 123.32,141.1 v126.1,141.1 | v126.1,181.85 IC1.4 | v126.1,161.65 IC2.4 v126.09,161.66 v126.1,161.65
  Route2 0.305: v138.35,142.5 138.35,143.55 188.95,143.55 188.95,140.75 v189.3,140.35
  Route2 0.406: v126.1,119.35 v126.1,141.1 v126.1,161.65 v126.1,181.85
  Route15 0.305: v126.1,141.1 126.1,139.85 126.45,139.5 136.35,139.5 138.35,141.5 v138.35,142.5
AD2  (via drill 0.4)
  Top 0.305: v139.55,142.3 139.55,143.5 v140.5,144.3 | U1.76 190.77,143.53 v190.75,144.3
  Top 0.406: IC4.7 127.64,115.55 v128.1,115.9 | IC3.7 v128.1,137.25 | IC2.7 v128.1,157.85 | v128.1,178.05 IC1.7
  Route2 0.305: v140.5,144.3 v190.75,144.3
  Route2 0.406: v128.1,115.9 v128.1,137.25 v128.1,157.85 v128.1,178.05
  Route15 0.305: v128.1,137.25 128.1,138.7 136.49,138.7 137.04,139.14 139.55,141.5 v139.55,142.3
AD3  (via drill 0.4)
  Top 0.305: v142.65,142.7 v142.65,146.85 | v191.55,146.85 191.55,140.67 U1.75
  Top 0.406: IC4.8 126.12,114.28 v127.2,114.25 | v127.2,135.95 123.3,135.95 IC3.8 | v127.2,176.75 123.3,176.75 IC1.8 | v127.2,156.55 123.3,156.55 IC2.8 127.17,156.57 v127.2,156.55
  Route2 0.406: v127.2,114.25 v127.2,135.95 v127.2,156.55 v127.2,176.75
  Route15 0.254: v142.65,146.85 v191.55,146.85
  Route15 0.305: v127.2,135.95 127.2,134.6 136.85,134.6 138.25,136 138.25,139 140.9,141.65 140.9,142.7 v142.65,142.7
AD4  (via drill 0.4)
  Top 0.254: U1.74 192.74,140.14 193.85,141.25 193.85,143.65
  Top 0.305: IC3.13 136.88,135.97 v138.3,134.55 | 193.85,143.65 v193.75,143.75
  Top 0.406: IC4.13 129.12,114.28 v128.95,114.45 | 129.25,135.9 129.3,135.9 | 132.95,135.9 133.25,135.9 IC3.13 133.03,135.97 132.95,135.9 | 132.95,135.9 129.3,135.9 | 129.3,135.9 v129,135.6 | IC2.13 133.3,156.6 v129,156.6 | v129,176.8 133.3,176.8 IC1.13
  Route2 0.406: v128.95,114.45 129,135.25 v129,135.6 v129,156.6 v129,176.8
  Route15 0.254: v138.1,145.8 143.7,145.8 144.2,146.3 190.25,146.3 190.75,145.8 191.85,145.8
  Route15 0.305: 191.85,145.8 v193.75,143.75
  Bottom 0.305: v138.3,134.55 138.3,138.15 137.2,139.25 137.2,144.9 v138.1,145.8
AD5  (via drill 0.4)
  Top 0.254: U1.73 192.84,139.64 194.7,141.5 v194.7,142.8
  Top 0.305: IC3.14 v135.25,137.25 | v137.35,137.25 v139.2,137.25
  Top 0.406: IC4.14 129.75,115.55 v129.8,115.5 | 130.09,137.2 130,137.2 v129.8,137 130.09,137.2 | 130.09,137.2 133.28,137.2 IC3.14 130.09,137.2 | IC2.14 v129.8,157.85 | v129.8,178.05 IC1.14
  Route2 0.406: v129.8,115.5 v129.8,137 v129.8,157.85 v129.8,178.05
  Route15 0.305: v135.25,137.25 v137.35,137.25 | v139.2,137.25 139.2,138.75 142.05,141.6 142.05,141.85 143.1,141.85 144,142.75 194.65,142.75 v194.7,142.8
AD6  (via drill 0.4)
  Top 0.305: U1.72 186.76,139.14 v185.5,140.4
  Top 0.406: IC4.17 130.91,119.36 v130.85,119.3 | IC3.17 v130.85,141.06 v130.85,141.05 | v130.85,181.85 IC1.17 | v130.85,161.65 IC2.17 v130.85,161.66 v130.85,161.65
  Route2 0.305: 130.9,151.05 130.85,151.1 v132,151.1
  Route2 0.406: v130.85,119.3 v130.85,141.05 130.85,141.6 130.85,151.1 v130.85,161.65 v130.85,181.85
  Route15 0.305: v132,151.1 136.25,151.1 136.25,147.85 v185.5,147.85
  Bottom 0.305: v185.5,147.85 v185.5,140.4
AD7  (via drill 0.4)
  Top 0.254: U1.71 193.04,138.64 193.05,139.25 194.5,140.5 194.9,140.85 v195.6,141.45
  Top 0.406: IC4.18 136.22,120.62 v136.25,120.65 | v136.25,142.35 133.35,142.35 IC3.18 | v136.25,183.1 133.35,183.1 IC1.18 | v136.25,162.9 133.35,162.9 IC2.18 136.22,162.93 v136.25,162.9
  Route2 0.305: 136.25,141 142.25,141 144,142.75 178,142.75 178.5,142.25 178.5,141.1 178.6,141 178.6,139.55 179,139.15 179,139.14 192.9,139.14 v195.6,141.45
  Route2 0.406: v136.25,120.65 136.25,141 v136.25,142.35 v136.25,162.9 v136.25,183.1
AD8  (via drill 0.4)
  Top 0.305: U1.53 v189.36,129.64 v189.35,129.65 | IC1.11 139.84,174.24 140.45,174.85 v140.6,174.85 | v206.05,145.5 206.05,162.55 205,163.6 189.75,163.6 187.5,165.85 185.9,165.85 185.9,173.9 184.55,175.25 181.85,175.25 179.6,177.5 v179.6,188.85
  Route2 0.305: v189.36,129.64 v189.36,129.66 190.56,129.66 191,129.65 | 191,129.65 192.1,129.65 | 192.1,129.65 192.15,129.65 | v189.35,129.65 191,129.65 | 192.1,129.65 192.1,134.15 | 192.1,134.15 192.15,134.2 | 192.15,134.2 194.7,134.2 195.95,135.45 198.9,135.45 202.8,139.35 202.8,142.25 v206.05,145.5 | 192.1,134.15 192.1,134.2 192.15,134.2
  Route15 0.305: v179.6,188.85 141,188.85 141,175.25 v140.6,174.85
AD9  (via drill 0.4)
  Top 0.305: U1.54 193.11,130.14 194.75,128.5 195.9,128.5 196.4,129 197.7,129 v197.9,128.8 197.95,128.75 | v191.55,148.3 200,148.3 v200.9,147.4
  Top 0.406: IC2.11 v137.87,154.03
  Route2 0.305: v197.9,128.8 197.9,129.4 199.8,131.3 202.3,131.3 203.5,132.5 203.5,141.7 204.65,141.7 204.8,141.85 v204.8,142.55 | v137.87,154.03 138.16,154.03 145.35,146.85 184.65,146.85 185.25,146.25 186.05,146.25 188.1,148.3 v191.55,148.3
  Bottom 0.305: v200.9,147.4 200.9,146.9 v204.8,142.55
AD10  (via drill 0.4)
  Top 0.305: IC3.11 137.22,133.44 137.75,132.9 138.95,132.9 139.55,133.5 139.55,134.7 139.6,134.75 141.75,134.75 v144.5,137.5 | U1.55 188.94,130.64 v188.65,130.6 | v184.85,121.25 189.15,121.25 189.8,120.6 189.8,118.7 191.65,116.85 191.65,110.45 174.6,110.45 v174.5,110.35
  Route2 0.305: v188.65,130.6 188.6,130.6 188.6,128.05 186.2,125.75 186.2,124.65 184.85,123.3 v184.85,121.25 | v165.4,123 163.3,125.1 157.85,125.1 156.05,126.9 156.05,132.3 156,132.3 150.8,137.5 v144.5,137.5
  Route15 0.305: v174.5,110.35 168.95,110.35 167.85,111.45 167.85,122.9 167.75,123 v165.4,123
AD11  (via drill 0.4)
  Top 0.305: 193.56,131.14 193.55,131.15 193.54,131.14 U1.56 193.56,131.14 | 193.56,131.14 194.7,130 v196.7,130 | IC4.11 136.76,111.73 v136.8,111.7 | v196.15,116.2 v196.15,112.25
  Route2 0.305: v194.25,125.4 194.25,120.7 194.55,120.4 198.65,120.4 v199.1,119.95
  Route15 0.305: v196.7,130 196.7,129.3 194.25,126.85 v194.25,125.4 | v136.8,111.7 138.65,111.7 139.9,112.95 151.9,112.95 152.35,112.5 v152.35,110.3 | v199.1,119.95 199.1,119.15 v196.15,116.2
  Bottom 0.305: v152.35,110.3 172.25,110.3 173.25,109.3 194.15,109.3 196.15,111.3 v196.15,112.25
AD12  (via drill 0.4)
  Top 0.305: U1.57 189.41,131.64 v188.85,132.2
  Top 0.406: IC1.1 123.35,185.66 v123.35,187.1
  Route2 0.305: v123.35,187.1 v123.35,169.95
  Route15 0.305: v123.35,169.95 v137.5,169.95 137.35,169.9 | v193.35,167.45 179.3,167.45 176.2,164.35 169.5,164.35 166.6,167.25 163.4,167.25 v163.35,167.2
  Bottom 0.305: v188.85,132.2 189.4,131.65 191.4,131.65 191.45,131.6 191.45,135.65 195.25,135.65 195.25,136.35 198.45,136.35 201.6,139.5 201.6,142.3 201.2,142.8 198.15,142.8 198.15,144.55 193.9,148.8 193.9,151.15 192.6,152.45 192.6,162.25 194.8,164.45 194.8,166 v193.35,167.45 | v163.35,167.2 163.35,166.6 161.85,165.1 161.85,163.55 149.9,163.55 149.9,168.2 144.6,168.2 142.85,169.95 v137.5,169.95
AD13  (via drill 0.4)
  Top 0.305: U1.58 193.96,132.14 195.05,131.05 196.1,131.05 v196.8,131.75 | v215.4,119.8 v215.4,112.7 | v146.65,136.3 v146.65,151
  Top 0.406: IC2.1 123.27,167.38 v123.25,167.4
  Route2 0.305: v147.85,114.15 154,114.15 155.25,115.4 155.25,131.75 150.7,136.3 v146.65,136.3
  Route15 0.305: v196.8,131.75 196.85,131.75 202.95,125.65 209.45,125.65 210.95,124.15 213.85,124.15 215.4,122.6 v215.4,119.8 | v215.4,112.7 213.9,112.7 213.9,111.05 177.55,111.05 v177.15,111.45 | v146.65,151 146.65,158.35 139.95,165.05
  Route15 0.406: v123.25,167.4 123.25,165.45 123.5,165.2 139.8,165.2 139.95,165.05
  Bottom 0.305: v177.15,111.45 149.6,111.45 148.9,112.15 148.9,113.45 v147.85,114.15
AD14  (via drill 0.4)
  Top 0.305: U1.59 195.41,132.64 v195.5,132.55 | v193,116.9 v193,112.4 | IC3.1 123.27,146.98 v123.25,147
  Route2 0.305: v195.5,132.55 195.5,130.2 193.6,128.3 190.45,128.3 188.85,126.7 188.85,119.2 190.95,116.9 v193,116.9 | v123.25,147 123.25,130.45 v123.2,130.4 | v138.35,126.3 v138.35,115.75
  Route15 0.305: v123.2,130.4 138.2,130.4 138.35,130.25 v138.35,126.3
  Bottom 0.305: v193,112.4 152.3,112.4 149,115.75 v138.35,115.75
AD15  (via drill 0.4)
  Top 0.305: U1.60 189.36,133.14 189.05,133.15 183.65,133.15 v181.75,135.05 | v170.45,125.7 170.45,124.65 170.35,124.55 165.85,124.55 164.45,126.15 160.35,126.15 v160.3,126.1
  Top 0.61: v123.3,125 123.3,123.19 IC4.1
  Route15 0.305: v181.75,135.05 179.05,135.05 178.8,134.8 170.5,134.8 170.45,134.75 v170.45,125.7 | v160.3,126.1 156.8,126.1 153.75,123.05 123.39,123.05 IC4.1 123.27,124.97 v123.3,125
B
  Top 0.305: U$8.7 275.37,28.14 X2.2
BUZZ
  Top 0.305: R1.2 188,142.67 U1.79
COL1
  Top 0.254: U1.63 194.14,134.64 195,135.27 206.85,135.27 207.4,134.8 220,134.8
  Top 0.305: 220,134.8 220,133.1 221.2,132.2 221.2,122.45 234.95,122.45 238.3,119.1 264.15,119.1 264.25,119
  Top 0.813: 267.17,119 K34.7
  Top 1.27: 264.25,119 267.17,119
COL2  (via drill 0.4)
  Top 0.254: U1.64 193.99,135.14 194.95,135.8 205.5,135.8 205.8,135.95 207,135.95 207.6,135.3 220.25,135.3
  Top 0.305: 220.25,135.3 220.85,134.7 220.85,133.9 v221.05,133.7
  Route15 0.305: v221.05,133.7 270.9,133.7 273.35,131.25 273.35,119.1 273.3,119.05
  Route15 1.27: 273.3,119.05 K34.8
COL3  (via drill 0.4)
  Top 0.254: U1.65 193.79,135.64 194.7,136.3 205.35,136.3 205.65,136.55 207.2,136.55 207.85,135.8 221.5,135.8
  Top 0.305: 221.5,135.8 222.15,135.15 222.15,123.8 222.6,123.35 v235.85,123.35
  Route2 0.305: v235.85,123.35 236.15,123.35 243,116.5
  Route2 0.406: 265.05,116.5 243,116.5
  Route2 1.27: K34.9 265,116.52 265.05,116.5
COL4  (via drill 0.4)
  Top 0.254: U1.66 193.69,136.14 194.55,136.85 205.25,136.85 205.55,137.15 207.3,137.15 208.1,136.3 225.05,136.3
  Top 0.305: 225.05,136.3 v225.1,136.25
  Route2 0.305: v225.1,136.25 225.1,133.8 225.25,133.65 270.9,133.7 273.35,131.25 273.35,116.7 273.2,116.55
  Route2 1.27: 273.2,116.55 269.8,116.55 K34.10
COL5  (via drill 0.4)
  Top 0.254: U1.67 193.59,136.64 194.55,137.45 205,137.45 205.5,137.78 207.35,137.78 208.35,136.8 224.15,136.8
  Top 0.305: 224.15,136.8 224.95,137.6 225.6,137.6 226.4,136.95 226.4,131.65 v232.72,125.17
  Route2 0.305: 243.95,113.95 v232.72,125.17
  Route2 0.406: 264.65,113.95 243.95,113.95
  Route2 1.27: K34.11 267,113.98 264.65,113.95
COL6  (via drill 0.4)
  Top 0.254: U1.68 193.49,137.14 194.5,138 204.9,138 205.2,138.3 207.65,138.3 208.6,137.35 221.94,137.35
  Top 0.305: 221.94,137.35 221.94,138.04 v223.45,139.55
  Route2 0.305: v223.45,139.55 223.85,140 227.95,140 227.95,134.7 228.1,134.55 272.3,134.55 v272.35,134.5
  Bottom 0.305: 273.3,114 273.3,129.15 272.35,130.1 v272.35,134.5
  Bottom 1.27: K34.12 273.28,113.98 273.3,114
COL7  (via drill 0.4)
  Top 0.254: U1.69 193.39,137.64 194.45,138.75 204.8,138.75 205,138.9 207.85,138.9 208.9,137.85 219.75,137.85
  Top 0.305: 219.75,137.85 v220.9,139.35
  Route2 0.305: 265.35,111.49 244.56,111.44 232.6,123.4 222.55,123.4 222.15,123.8 222.15,135.05 220.9,136.3 v220.9,139.35
  Route2 1.27: K34.13 265,111.45 265.35,111.49
COM1-8  (via drill 0.4)
  Top 0.813: 45.48,178.15 K2.P | 45.48,140.1 K4.P
  Top 1.422: X3.1 11.08,190.38 v17.8,197.1 | v36.65,197 36.65,178.15 45.48,178.15 | K2.P 36.6,178.2 36.6,159.2 | K3.P 36.6,159.2 | 36.6,159.2 36.6,140.1 45.48,140.1
  Bottom 0.813: 45.42,197.1 K1.P | 36.75,197.1 v36.65,197 | 88.2,205.65 87.95,205.9 | 88.2,159.2 88.15,159.2 | 96.08,140.4 K8.P
  Bottom 1.422: v17.8,197.1 36.75,197.1 45.42,197.1 | 87.95,205.9 38,205.9 36.65,204.55 v36.65,197 | 88.2,205.65 88.2,197.2 | 88.2,197.2 88.2,178.2 | 88.2,178.2 88.2,159.2 K7.P | 88.15,159.2 88.15,140.4 96.08,140.4 | K6.P 88.2,178.2 | K5.P 88.2,197.2
COM9-16
  Top 1.27: K9.P 37.6,121.2 37.6,120.9 37.25,120.9 37.25,102.3 | 37.25,102.3 45.52,102.3 K10.P | K11.P 37.25,83.2 | 37.25,83.2 37.25,102.3 | K12.P 37.25,64.2 37.25,83.2
  Bottom 1.27: 88,101.9 88,121.2 K13.P K9.P | 88,101.9 96.08,101.9 K14.P | K15.P 88,83.2 | 88,83.2 88,101.9 | K16.P 88,64.2 88,83.2
  Bottom 1.422: X4.1 16.53,125.32 21.05,121.2 K9.P
COM17-24  (via drill 0.4)
  Top 1.27: K19.P 89.4,45.2 87.55,42.7 87.55,28.2 90.1,26.05 K20.P | v37.15,32.35 39.45,30.05 39.45,26.05 39.47,26.03 K18.P 45.45,25.95 | v37.15,38.2 37.15,43.3 39.05,45.2 K17.P | K23.P 152.8,83.34 152.8,76.8 151.45,76.05 137.05,76.05 135.37,76.83 K22.P 135.35,83.39 v135.35,71.8
  Top 1.422: X5.1 15.98,65.32 17.05,64.25 17.05,38 29.1,25.95 45.45,25.95
  Route2 1.27: K19.P 135.4,45.2 K21.P
  Bottom 1.27: v37.15,32.35 v37.15,38.2 | K19.P 68.55,45.2 68.5,45.15 45.58,45.15 K17.P | K24.P 152.95,41.2 152.95,35.65 151.55,34.1 137.2,34.15 135.4,35.65 K21.P 135.37,41.26 135.37,71.78 v135.35,71.8
COM25-32
  Top 0.406: 186.95,75.95 221.45,75.95 222.75,77.25
  Top 1.27: K29.P 170.37,77.28 172.1,75.95 186.95,75.95 | 186.95,75.95 187.9,77.4 187.9,83.39 K30.P | K31.P 205.37,77.72 204.15,75.95 | 204.15,75.95 186.95,75.95 | K32.P 222.87,77.22 221.9,76 204.15,75.95 | K25.P 170.4,34.15 170.85,33.7 187.8,33.7 | 187.8,33.7 187.9,33.7 | 187.9,33.7 K26.P 187.9,33.95 187.85,33.9 187.85,33.75 187.8,33.7 | K27.P 205.4,34.05 | 205.4,34.05 205,33.65 187.95,33.65 187.9,33.7 | K28.P 222.9,36.2 222.8,36.1 222.8,33.7 222.55,33.65 205.55,33.65 205.4,34.05
  Route2 1.27: 222.95,63.6 222.9,63.8 222.9,83.39 K32.P | 222.95,63.6 222.95,63.1 | K28.P 222.9,63.55 222.95,63.6
  Bottom 1.27: X6.1 169.68,13.63 170.3,14.25 170.3,41.16 K25.P
CON1
  Bottom 0.813: X1.2 232.24,193.46 232.85,192.85 234.1,192.85 236.8,190.15 236.8,186.23 OK34.2
CON2
  Bottom 0.813: X1.3 227.16,193.74 229.8,191.1 229.8,186.23 OK35.2
CON3
  Bottom 0.813: X1.4 222.08,191.52 222.8,190.8 222.8,186.23 OK36.2
CON4
  Bottom 0.813: X1.5 217,192.15 215.75,190.9 215.75,186.24 OK37.2
CON5
  Bottom 0.813: X1.6 211.92,192.92 211.75,192.75 211.2,192.75 208.75,190.3 208.75,186.24 OK38.2
CON6
  Bottom 0.813: X1.7 206.84,193.19 206.65,193 202.9,193 201.75,191.85 201.75,186.24 OK39.2
CON7
  Bottom 0.813: X1.8 201.76,195.31 199.3,192.85 194.85,192.85 194.75,192.95 194.75,186.24 OK40.2
CON8
  Bottom 0.813: X1.9 191.52,198.92 187.7,195.1 187.7,186.29 OK41.2
DB4  (via drill 0.4)
  Top 0.254: U1.70 193.24,138.14 194.2,139.3 204.45,139.3 204.8,139.45 208.1,139.45 209.15,138.4 218.2,138.4
  Top 0.305: 218.2,138.4 v219.05,139.25
  Route2 0.305: v219.05,139.25 219.05,133.6 220.05,132.6 220.05,124.25 v219.05,123.25 | v219.05,120 219.05,109.05 221.75,106.35 264.4,106.35
  Route2 1.27: K34.17 264.41,106.36 264.4,106.35
  Route15 0.305: v219.05,123.25 v219.05,120
DB5  (via drill 0.4)
  Top 0.305: U1.28 178.47,125.57 178.25,125.35 v174.6,125.35
  Route15 0.305: 273.4,106.35 273.75,106 273.75,102.75 272.55,101.55 264.55,101.55 262.3,103.8 183.45,103.8 174.6,112.6 v174.6,125.35
  Route15 1.27: K34.18 273.29,106.36 273.4,106.35
DB6  (via drill 0.4)
  Top 0.305: U1.29 178.97,124.6 v176.4,124.6
  Route2 0.305: 264.2,103.82 264.2,103.85 183.43,103.82 176.4,110.8 174.6,112.6 174.6,123.9 175.3,124.6 v176.4,124.6
  Route2 0.813: K34.19 264.2,103.82
DB7  (via drill 0.4)
  Top 0.305: U1.1 175.15,140.64 175.15,141.71 174.65,142.75 166.51,142.74 v166.5,141.65
  Route15 0.305: v162.6,123 162.6,111.35 165.25,108.7 177.2,108.7 183.4,102.5 261.65,102.5 261.65,102.45 264.1,100 273.1,100 v273.7,100.6
  Bottom 0.305: 272.6,103.8 273.6,103.8 | 273.6,103.8 273.7,103.8 | v166.5,141.65 166.55,141.6 166.55,126.95 v162.6,123 | v273.7,100.6 273.7,103.7 273.6,103.8
  Bottom 1.27: K34.20 272.58,103.82 272.6,103.8
DIG0  (via drill 0.4)
  Top 0.61: v251.85,155.8 251.85,150.14 U$3.2
  Route15 0.305: 265.45,178.45 264.8,178.45 264.55,178.2 264.55,174.2 263.95,173.6 258,173.6 256.9,172.5 256.9,160.7 v251.85,155.8
  Route15 0.813: 265.5,178.5 265.45,178.45
  Route15 1.27: K35.5 265.5,178.5
DIG1  (via drill 0.4)
  Top 0.61: v240.45,153.45 240.45,150.14 U$3.11
  Route2 0.813: 272.85,178.5 v272.9,178.45
  Route2 1.27: K35.6 272.85,178.5
  Route15 0.305: v272.9,178.45 273.9,178.45 274.65,177.7 274.65,158.35 274.45,158.15 272.9,158.15 269.1,154.05 269.05,154 241,154 v240.45,153.45
DIG2
  Top 0.305: 266.01,175.96 263.65,173.6 258,173.6 256.9,172.5 256.9,160.7 253.05,156.85 246.8,156.85 246.8,152.45
  Top 0.61: 246.8,152.45 246.8,150.14 U$3.6
  Top 1.27: K35.7 266.01,175.96
DIG3  (via drill 0.4)
  Top 0.305: 272.9,175.95 274.35,175.95 274.65,175.6 274.65,158.15 272.9,158.15 271.65,156.85 v261.8,156.85 | 245.51,152.31 245.51,156.03 v244.7,156.85
  Top 0.61: U$3.7 245.51,152.31
  Top 0.813: K35.8
  Top 1.27: 272.9,175.95 K35.8
  Route2 0.305: v244.7,156.85 v261.8,156.85
EN  (via drill 0.4)
  Top 0.305: U1.52 192.61,129.14 194.05,127.7 v197,127.7 | v211.25,121.75 234.25,121.75 254.4,101.6 272.6,101.6 273.6,102.6 273.6,108.55 273.3,108.85 | 269.82,108.85 K34.16
  Top 1.27: 273.3,108.85 269.82,108.85
  Route2 0.305: v197,127.7 197,126.65 207.7,126.65 208.95,125.25 208.95,122.55 209,122.5 210.5,122.5 v211.25,121.75
GND  (via drill 0.4)
  Top 0.254: 186.97,142.33 186.95,142.3 186.95,141.55 | 177.97,141.7 177.95,141.9 178,141.95
  Top 0.305: C3.2 176.05,122.84 177.5,122.84 v177.93,122.82 | U1.32 v180.47,128.68 180.47,128.72 180.45,128.75 | U$1.4 210.35,120 v209.8,120.55 | v205.9,120.9 C43.2 | U$6.14 242.43,23.55 | 242.43,23.55 242.43,21.62 240.5,19.7 | C38.1 237.55,24.8 238.9,23.45 242.32,23.45 242.43,23.55 | U$6.1 247.37,31.12 247.95,31.7 C37.2 252.95,31.7 254.05,32.8 R90.1 | C39.2 249.65,24 249.4,23.75 245.3,23.75 245.05,24 245.05,25.26 U$6.18 | U1.62 190.99,134.14 190.95,134.1 189.25,134.1 v189.05,134.3 | U1.81 186.97,142.33 | 186.95,141.55 186.65,141.2 | C1.2 177.75,145.05 177.75,144.45 177.97,144.23 U1.99 177.97,141.7 177.97,141.35 178.05,141.3 182.75,141.3 v183.85,140.2 | U1.11 176.44,135.64 176.45,135.6 177.9,135.6 178.35,135.2